# EAGLE schematic BEP32_12nutzen_90Grad (EAGLE 6.4), part 2 of 4
## Sheet 5 of 12
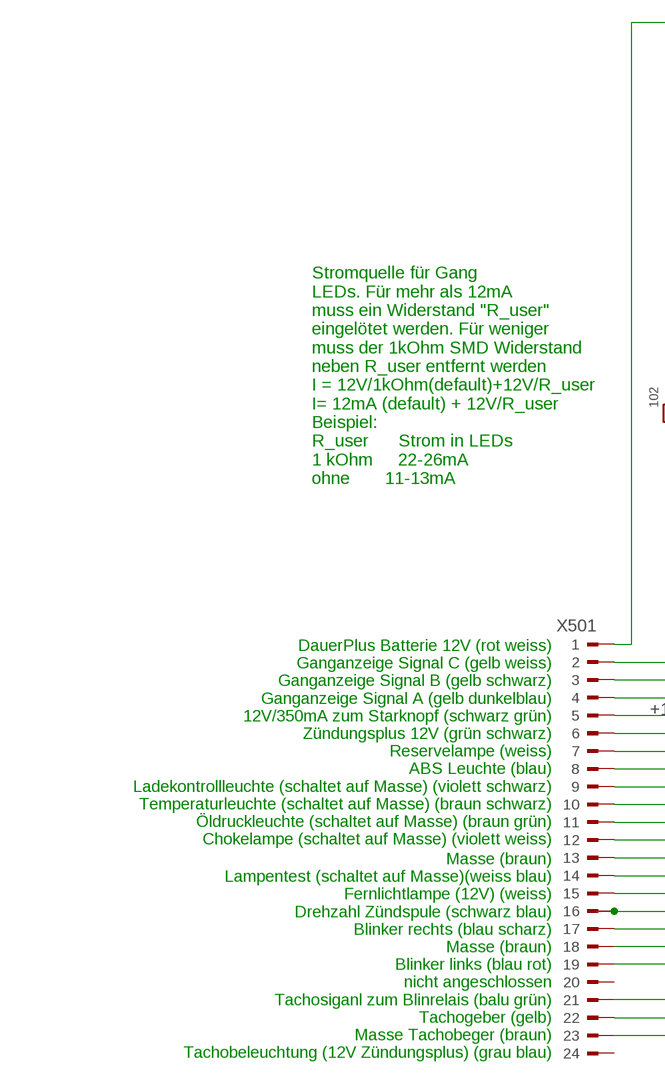
[diagram p8: schematic, sheet 5, part 1 of 2]
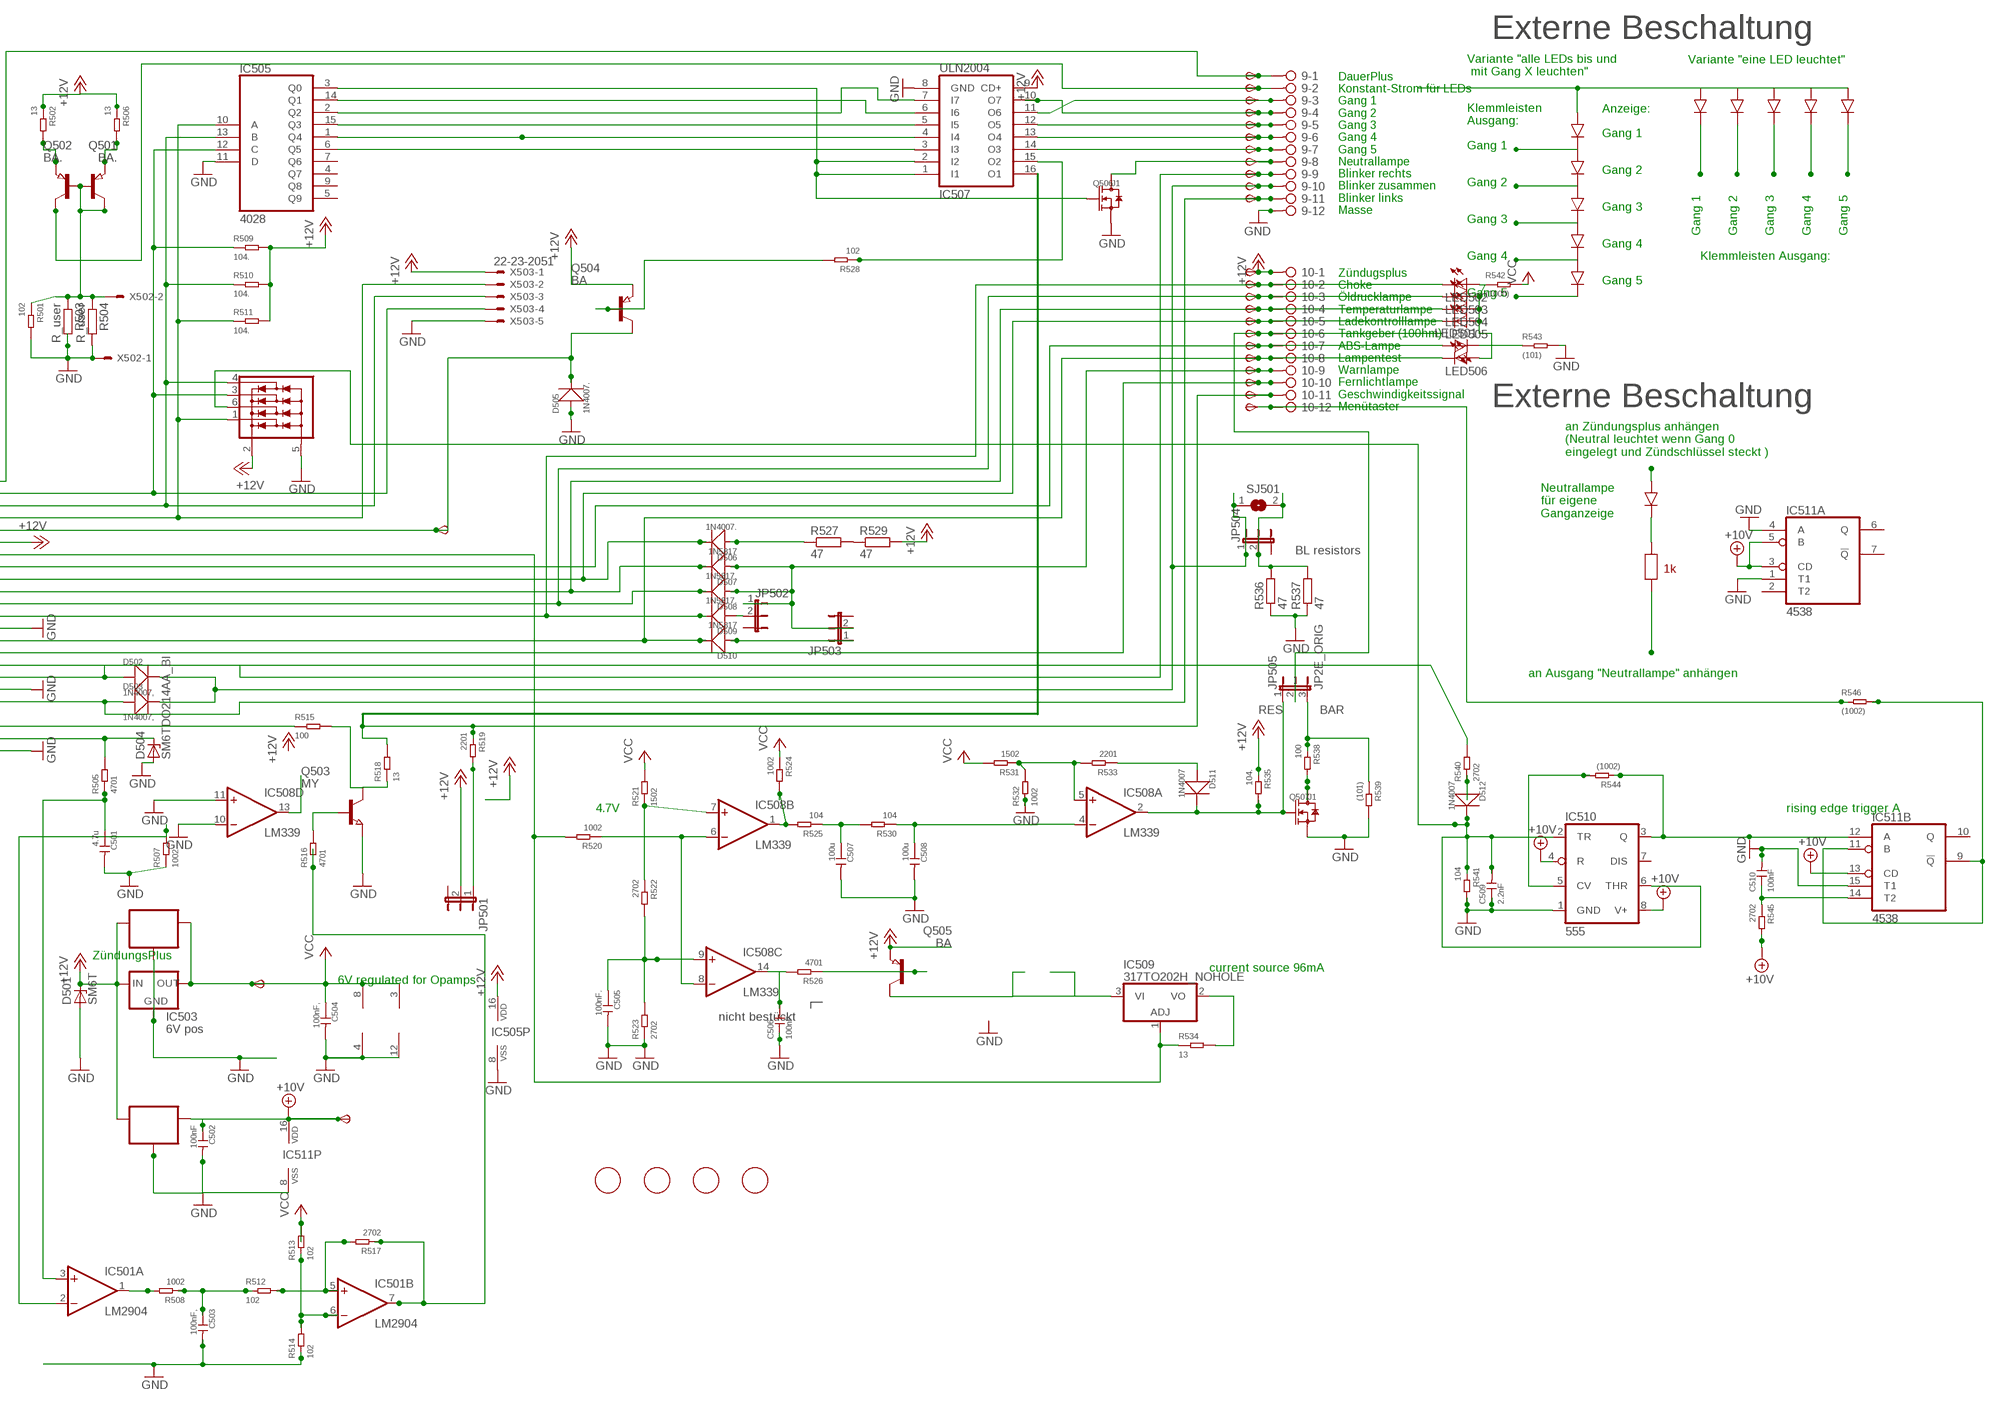
[diagram p9: schematic, sheet 5, part 2 of 2]

### Parts
6V501  TPSB2.0  [B2.0]
9  2081-1132  [12-PIN]
10  2081-1132  [12-PIN]
10V501  TPSB2.0  [B2.0]
C501  4.7u  CERAMIC-4.7UF-25V-10%-X5R(0805)  [C0805]
C502  100nF  CERAMIC-100NF-50V-10%-X7R(0805)  [C0805]
C503  100nF,  CERAMIC-100NF-50V-10%-X7R(0805)  [C0805]
C504  100nF,  CERAMIC-100NF-50V-10%-X7R(0805)  [C0805]
C505  100nF.  CERAMIC-100NF-50V-10%-X7R(0805)  [C0805]
C506  100nF.  CERAMIC-100NF-50V-10%-X7R(0805)  [C0805]
C507  100u  CERAMIC-100UF-6.3V-20%-X5R(1206)  [C1206]
C508  100u  CERAMIC-100UF-6.3V-20%-X5R(1206)  [C1206]
C509  2.2nF  CERAMIC-100NF-50V-10%-X7R(0805)  [C0805]
C510  100nF  CERAMIC-100NF-50V-10%-X7R(0805)  [C0805]
D501  SM6T  [DO214AA]
D502  1N4007,  DIODE-GEN-PURPOSE-1KV-1A(DO-214AC)  [DO-214AC]
D503  1N4007,  DIODE-GEN-PURPOSE-1KV-1A(DO-214AC)  [DO-214AC]
D504  SM6TDO214AA_BI  [DO214AA_BI]
D505  1N4007.  DIODE-GEN-PURPOSE-1KV-1A(DO-214AC)  [DO-214AC]
D506  1N4007.  DIODE-GEN-PURPOSE-1KV-1A(DO-214AC)  [DO-214AC]
D507  1N5817  DIODE-GEN-PURPOSE-1KV-1A(DO-214AC)DO-214AC/1206  [DO-214AC_SLIM]
D508  1N5817.  DIODE-GEN-PURPOSE-1KV-1A(DO-214AC)DO-214AC/1206  [DO-214AC_SLIM]
D509  1N5817.  DIODE-GEN-PURPOSE-1KV-1A(DO-214AC)DO-214AC/1206  [DO-214AC_SLIM]
D510  1N5817  DIODE-GEN-PURPOSE-1KV-1A(DO-214AC)DO-214AC/1206  [DO-214AC_SLIM]
D511  1N4007  DIODE-GEN-PURPOSE-1KV-1A(DO-214AC)  [DO-214AC]
D512  1N4007  DIODE-GEN-PURPOSE-1KV-1A(DO-214AC)  [DO-214AC]
FID501  FIDUCIAL  [FIDUCIAL_1MM]
FID502  FIDUCIAL  [FIDUCIAL_1MM]
FID503  FIDUCIAL  [FIDUCIAL_1MM]
FID504  FIDUCIAL  [FIDUCIAL_1MM]
IC501  LM2904  LM358D  [SO08]
IC502  78L06  78LXXSOT89_ROUND  [SOT89_ROUND]
IC503  6V pos  78LXX  [78LXX]
IC504  78L10  78LXXSOT89_ROUND  [SOT89_ROUND]
IC505  4028  4028D  [SO16]
IC506  NUP4304SOT457_R  [SOT457R_PHILIPS]
IC507  ULN2004  ULN2004AD  [SO16]
IC508  LM339  LM339D  [SO14]
IC509  317TO202H_NOHOLE  [TO220H_NOHOLE]
IC510  555  NE555D  [SO08]
IC511  4538  4538D  [SO16]
JP501  JP2EJP2_SMALLPADS  [JP2_SMALLPADS]
JP502  JP2EJP2_SMALLPADS  [JP2_SMALLPADS]
JP503  JP2EJP2_SMALLPADS  [JP2_SMALLPADS]
JP504  JP2EJP2_SMALLPADS  [JP2_SMALLPADS]
JP505  JP2E_ORIG  [JP2_ORIG_SMALLPADS]
LED501  LEDLD260  [LD260]
LED502  LEDLD260  [LD260]
LED503  LEDLD260  [LD260]
LED504  LEDLD260  [LD260]
LED505  LEDLD260  [LD260]
LED506  LEDLD260  [LD260]
Q501  BA.  PNP-TRANSISTOR_SOT89  [SOT89]
Q502  BA.  PNP-TRANSISTOR_SOT89  [SOT89]
Q503  MY  NPN-TRANSISTOR_SOT89  [SOT89]
Q504  BA  PNP-TRANSISTOR_SOT89  [SOT89]
Q505  BA  PNP-TRANSISTOR_SOT89  [SOT89]
Q506  J1  SMD-MOSFET-N-CH-50V-200MA-BSS138W-7-F(SOT-23)  [SOT-23]
Q507  J1  SMD-MOSFET-N-CH-50V-200MA-BSS138W-7-F(SOT-23)  [SOT-23]
R501  102  SMD-RES-1K-5%-1/8W(0805)  [R0805]
R502  13  SMD-RES-13R-5%-1/4W(1206)  [R1206]
R503  R_user  R-EU_R0805  [R0805]
R504  R_user  R-EU_R0805  [R0805]
R505  4701  SMD-RES-4.7K-5%-1/8W(0805)  [R0805]
R506  13  SMD-RES-13R-5%-1/4W(1206)  [R1206]
R507  1002  SMD-RES-10K-1%-1/8W(0805)  [R0805]
R508  1002  SMD-RES-10K-1%-1/8W(0805)  [R0805]
R509  104.  SMD-RES-10K-1%-1/8W(0805)  [R0805]
R510  104.  SMD-RES-10K-1%-1/8W(0805)  [R0805]
R511  104.  SMD-RES-10K-1%-1/8W(0805)  [R0805]
R512  102  SMD-RES-1K-5%-1/8W(0805)  [R0805]
R513  102  SMD-RES-1K-5%-1/8W(0805)  [R0805]
R514  102  SMD-RES-1K-5%-1/8W(0805)  [R0805]
R515  100  SMD-RES-220R-5%-1/8W(0805)  [R0805]
R516  4701  SMD-RES-4.7K-5%-1/8W(0805)  [R0805]
R517  2702  SMD-RES-4.7K-5%-1/8W(0805)  [R0805]
R518  13  SMD-RES-13R-5%-1/4W(1206)  [R1206]
R519  2201  SMD-RES-2.2K-5%-1/8W(0805)  [R0805]
R520  1002  SMD-RES-10K-1%-1/8W(0805)  [R0805]
R521  1502  SMD-RES-10K-1%-1/8W(0805)  [R0805]
R522  2702  SMD-RES-4.7K-5%-1/8W(0805)  [R0805]
R523  2702  SMD-RES-4.7K-5%-1/8W(0805)  [R0805]
R524  1002  SMD-RES-10K-1%-1/8W(0805)  [R0805]
R525  104  SMD-RES-10K-1%-1/8W(0805)  [R0805]
R526  4701  SMD-RES-4.7K-5%-1/8W(0805)  [R0805]
R527  47  R-EU_V235/17_1MM  [V235/17_1MM]
R528  102  SMD-RES-1K-5%-1/8W(0805)  [R0805]
R529  47  R-EU_V235/17_1MM  [V235/17_1MM]
R530  104  SMD-RES-10K-1%-1/8W(0805)  [R0805]
R531  1502  SMD-RES-10K-1%-1/8W(0805)  [R0805]
R532  1002  SMD-RES-10K-1%-1/8W(0805)  [R0805]
R533  2201  SMD-RES-2.2K-5%-1/8W(0805)  [R0805]
R534  13  SMD-RES-13R-5%-1/4W(1206)  [R1206]
R535  104.  SMD-RES-10K-1%-1/8W(0805)  [R0805]
R536  47  R-EU_V235/17_1MM  [V235/17_1MM]
R537  47  R-EU_V235/17_1MM  [V235/17_1MM]
R538  100  SMD-RES-2.2K-5%-1/8W(0805)  [R0805]
R539  (101)  SMD-RES-2.2K-5%-1/8W(0805)  [R0805]
R540  2702  SMD-RES-10K-1%-1/8W(0805)  [R0805]
R541  104  SMD-RES-10K-1%-1/8W(0805)  [R0805]
R542  (1000)  SMD-RES-100R-5%-1/8W(0805)  [R0805]
R543  (101)  SMD-RES-100R-5%-1/8W(0805)  [R0805]
R544  (1002)  SMD-RES-10K-1%-1/8W(0805)  [R0805]
R545  2702  SMD-RES-4.7K-5%-1/8W(0805)  [R0805]
R546  (1002)  SMD-RES-4.7K-5%-1/8W(0805)  [R0805]
SJ501  SJ  [SJ]
START501  TPSB2.0  [B2.0]
TP93  TPSB2.0  [B2.0]
TP94  TPSB2.0  [B2.0]
TP95  TPSB2.0  [B2.0]
TP96  TPSB2.0  [B2.0]
TP97  TPSB2.0  [B2.0]
TP98  TPSB2.0  [B2.0]
TP99  TPSB2.0  [B2.0]
TP100  TPSB2.0  [B2.0]
TP101  TPSB2.0  [B2.0]
TP102  TPSB2.0  [B2.0]
TP103  TPSB2.0  [B2.0]
TP104  TPSB2.0  [B2.0]
TP105  TPSB2.0  [B2.0]
TP106  TPSB2.0  [B2.0]
TP107  TPSB2.0  [B2.0]
TP108  TPSB2.0  [B2.0]
TP109  TPSB2.0  [B2.0]
TP110  TPSB2.0  [B2.0]
TP111  TPSB1,27  [B1,27]
TP112  TPSB2.0  [B2.0]
TP113  TPSB2.0  [B2.0]
TP114  TPSB2.0  [B2.0]
TP115  TPSB2.0  [B2.0]
X501  CON_BMWV2  [24-PIN_V2]
X502  22-23-2021  [22-23-2021]
X503  22-23-2051  [22-23-2051]

### Nets
+10V: 10V501.TP(PP) C502.1 IC504.1(OUT) IC510.4(R) IC510.8(V+) IC511.3(A:CD) IC511.5(A:B) IC511.13(B:CD) IC511.16(P:VDD) R545.2 ; also sheet 1,2,3,4,6,7,8,9,10,11,12
+12V: 10.1 D501.C IC502.3(IN) IC503.IN IC504.3(IN) IC505.16(VDD) IC506.2(V+) IC507.9(CD+) JP501.2 Q504.3(E) Q505.3(E) R502.1 R506.1 R509.2 R510.2 R511.2 R529.2 R535.1 TP114.TP(PP) X501.6 X503.1 ; also sheet 1,2,3,4,6,7,8,9,10,11,12
+12V5: IC501.7(B:OUT) R516.1 R517.1
GND: 9.12 C501.2 C502.2 C503.2 C504.2 C505.2 C506.1 C507.2 C508.2 C509.1 C510.2 D501.A D504.A D505.1(+) IC501.4(P:V-) IC502.2(GND) IC502.2@1(GND) IC503.GND IC504.2(GND) IC504.2@1(GND) IC505.8(VSS) IC505.11(D) IC506.5(V-) IC507.8(GND) IC508.10(D:-IN) IC508.11(D:+IN) IC508.12(P:GND) IC510.1(GND) IC511.1(A:T1) IC511.4(A:A) IC511.8(P:VSS) IC511.15(B:T1) Q503.3(E) Q506.2(S) Q507.2(S) R501.2 R503.2 R504.2 R507.1 R514.1 R523.1 R532.1 R536.1 R537.1 R539.2 R541.2 R543.2 X501.13 X501.18 X501.23 X502.1 X503.5 ; also sheet 1,2,3,4,6,7,8,9,10,11,12
N$389: R527.2 R529.1
N$390: 10.9 D507.1(+) D508.1(+) JP502.1 JP503.2 TP111.TP(PP)
N$391: IC505.10(A) IC506.1(D1) R511.1 X501.4 X503.2
N$392: IC505.13(B) IC506.4(D4) R510.1 X501.3 X503.3
N$393: D505.2(-) Q504.2(C) START501.TP(PP) X501.5
N$394: IC505.12(C) IC506.3(D3) R509.1 X501.2 X503.4
N$395: 10.7 LED501.A TP109.TP(PP) X501.8
N$396: 10.2 D509.2(-) LED502.K(C) TP104.TP(PP) X501.12
N$397: 10.3 D508.2(-) LED503.K(C) TP105.TP(PP) X501.11
N$398: 10.4 D507.2(-) LED504.K(C) TP106.TP(PP) X501.10
N$399: 10.8 D510.2(-) LED506.K(C) TP110.TP(PP) X501.14
N$400: 9.9 D502.1(+) TP101.TP(PP) X501.17
N$401: 9.11 D503.1(+) TP103.TP(PP) X501.19
N$402: D504.C R505.2 X501.22
N$403: C501.1 IC501.3(A:+IN) R505.1
N$404: 10.11 IC507.16(O1) R518.2 R519.1 TP113.TP(PP)
N$405: IC508.1(B:OUT) R524.2 R525.2
N$406: C507.1 R525.1 R530.2
N$407: C508.1 IC508.4(A:-IN) R530.1
N$408: IC508.5(A:+IN) R531.1 R532.2 R533.2
N$409: D511.1(+) R533.1
N$410: C505.1 IC508.9(C:+IN) R522.2 R523.2
N$411: C506.2 IC508.14(C:OUT) R526.2
N$412: Q505.1(B) R526.1
N$413: IC505.2(Q2) IC507.7(I7)
N$414: 9.5 IC507.12(O5) TP97.TP(PP)
N$415: IC505.1(Q4) IC507.4(I4)
N$416: 9.8 Q506.3(D) TP100.TP(PP)
N$417: 10.10 TP112.TP(PP) X501.15
N$418: 10.5 D506.2(-) LED505.K(C) TP107.TP(PP) X501.9
N$419: D506.1(+) R527.1
N$420: IC505.6(Q5) IC507.3(I3)
N$421: 9.4 IC507.10(O7) TP96.TP(PP)
N$422: IC509.1(ADJ) R520.2 R534.1 X501.7
N$423: IC508.6(B:-IN) IC508.8(C:-IN) R520.1
N$424: 9.2 Q501.2(C) TP94.TP(PP)
N$425: 9.1 TP93.TP(PP) X501.1
N$439: R540.2 X501.16
N$440: IC505.15(Q3) IC507.5(I5)
N$441: 9.6 IC507.13(O4) TP98.TP(PP)
N$442: 9.7 IC507.14(O3) TP99.TP(PP)
N$443: 10.6 JP505.2 TP108.TP(PP)
N$444: LED501.K(C) R543.1
N$445: LED502.A LED503.A LED504.A LED505.A LED506.A R542.1
N$446: Q504.1(B) R528.2
N$447: IC505.3(Q0) IC507.1(I1) IC507.2(I2) Q506.1(G)
N$448: IC505.14(Q1) IC507.6(I6)
N$449: 9.3 IC507.11(O6) TP95.TP(PP)
N$450: Q501.1(B) Q502.1(B) Q502.2(C) R501.1 R503.1 R504.1 X502.2
N$451: Q501.3(E) R502.2
N$452: Q502.3(E) R506.2
N$453: IC508.7(B:+IN) R521.1 R522.1
N$454: IC501.2(A:-IN) R507.2
N$455: Q503.1(B) R516.2
N$456: Q507.3(D) R538.2
N$457: IC509.2(VO) R534.2
N$458: IC509.3(VI) Q505.2(C)
N$459: C509.2 D512.2(-) IC506.6(D2) IC510.2(TR) IC510.6(THR) R541.1
N$460: IC510.5(CV) R544.2
N$461: IC510.3(Q) IC511.12(B:A) R544.1
N$462: D512.1(+) R540.1
N$463: 9.10 D502.2(-) D503.2(-) JP504.1 SJ501.1 TP102.TP(PP)
N$464: JP504.2 R536.2 R537.2 SJ501.2
N$465: IC511.9(B:!Q) IC511.11(B:B) R546.2
N$466: C510.1 IC511.14(B:T2) R545.1
N$467: JP501.1 R519.2
N$468: IC507.15(O2) R528.1
N$469: 10.12 R546.1 TP115.TP(PP)
N$470: D509.1(+) JP502.2
N$471: D511.2(-) IC508.2(A:OUT) JP505.1 Q507.1(G) R535.2
N$472: IC501.1(A:OUT) R508.2
N$473: C503.1 R508.1 R512.1
N$474: IC501.5(B:+IN) R512.2 R517.2
N$475: IC501.6(B:-IN) R513.1 R514.2
N$476: D510.1(+) JP503.1
N$477: JP505.3 R538.1 R539.1
N$478: IC508.13(D:OUT)
N$479: R515.1 X501.21
N$480: Q503.2(C) R515.2 R518.1
VCC: 6V501.TP(PP) C504.1 IC501.8(P:V+) IC502.1(OUT) IC503.OUT IC508.3(P:V+) R513.2 R521.2 R524.1 R531.2 R542.2 ; also sheet 1,2,3,4,6,7,8,9,10,11,12
Unconnected: IC505.4(Q7) IC505.5(Q9) IC505.7(Q6) IC505.9(Q8) IC510.7(DIS) IC511.2(A:T2) IC511.6(A:Q) IC511.7(A:!Q) IC511.10(B:Q) X501.20 X501.24

### Notes on the sheet
- Externe Beschaltung
- Variante "eine LED leuchtet"
- Variante "alle LEDs bis und
   mit Gang X leuchten"
- Anzeige:
- Klemmleisten
  Ausgang:
- Gang 1
- DauerPlus
  Konstant-Strom für LEDs
  Gang 1
  Gang 2
  Gang 3
  Gang 4
  Gang 5
  Neutrallampe
  Blinker rechts
  Blinker zusammen
  Blinker links
  Masse
- Gang 1
- Gang 2
- Gang 2
- Gang 3
- Gang 3
- Gang 1 | Gang 2 | Gang 3 | Gang 4 | Gang 5
- Gang 4
- Gang 4 | Klemmleisten Ausgang:
- Gang 5
- Gang 5
- Zündugsplus
  Choke
  Öldrucklampe
  Temperaturlampe
  Ladekontrolllampe
  Tankgeber (100hm)
  ABS-Lampe
  Lampentest
  Warnlampe
  Fernlichtlampe
  Geschwindigkeitssignal
  Menütaster
- Stromquelle für Gang
  LEDs. Für mehr als 12mA
  muss ein Widerstand "R_user"
  eingelötet werden. Für weniger
  muss der 1kOhm SMD Widerstand
  neben R_user entfernt werden
  I = 12V/1kOhm(default)+12V/R_user
  I= 12mA (default) + 12V/R_user
  Beispiel:
  R_user      Strom in LEDs
  1 kOhm     22-26mA
  ohne       11-13mA
- Externe Beschaltung
- an Zündungsplus anhängen
  (Neutral leuchtet wenn Gang 0
  eingelegt und Zündschlüssel steckt )
- Neutrallampe
  für eigene
  Ganganzeige
- DauerPlus Batterie 12V (rot weiss)
  Ganganzeige Signal C (gelb weiss)
  Ganganzeige Signal B (gelb schwarz)
  Ganganzeige Signal A (gelb dunkelblau)
  12V/350mA zum Starknopf (schwarz grün)
  Zündungsplus 12V (grün schwarz)
  Reservelampe (weiss)
  ABS Leuchte (blau)
  Ladekontrollleuchte (schaltet auf Masse) (violett schwarz)
  Temperaturleuchte (schaltet auf Masse) (braun schwarz)
  Öldruckleuchte (schaltet auf Masse) (braun grün)
  Chokelampe (schaltet auf Masse) (violett weiss)
- BL resistors
- 1k
- an Ausgang "Neutrallampe" anhängen
- Masse (braun)
  Lampentest (schaltet auf Masse)(weiss blau)
  Fernlichtlampe (12V) (weiss)
  Drehzahl Zündspule (schwarz blau)
  Blinker rechts (blau scharz)
  Masse (braun)
  Blinker links (blau rot)
  nicht angeschlossen
  Tachosiganl zum Blinrelais (balu grün)
  Tachogeber (gelb)
  Masse Tachobeger (braun)
  Tachobeleuchtung (12V Zündungsplus) (grau blau)
- RES | BAR
- 4.7V | rising edge trigger A
- ZündungsPlus
- current source 96mA
- 6V regulated for Opamps
- nicht bestückt

## Sheet 6 of 12
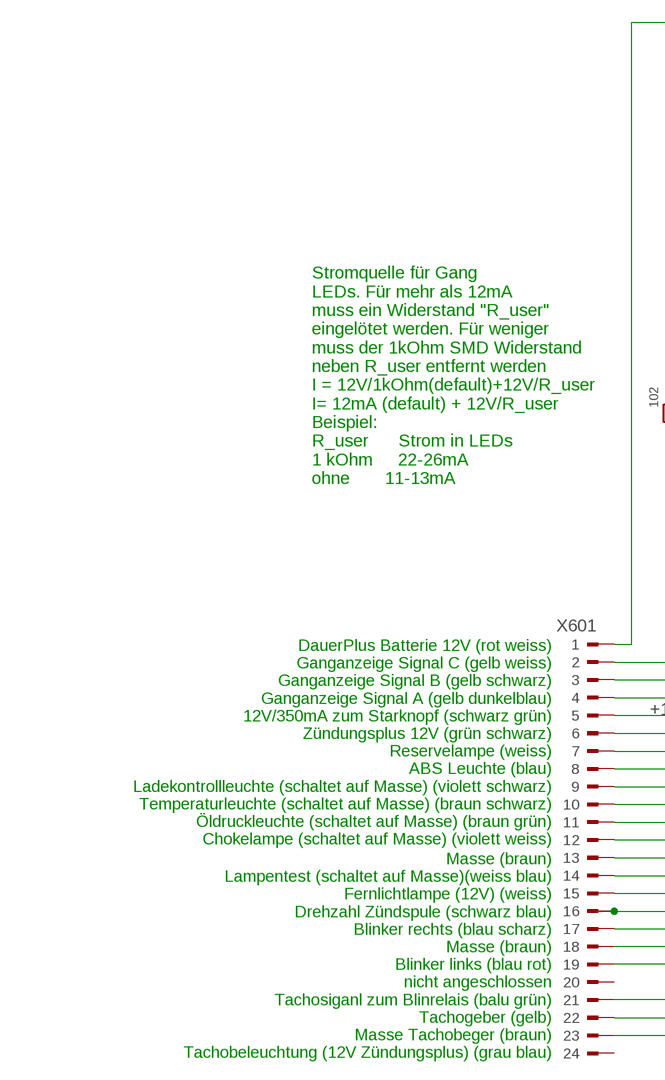
[diagram p10: schematic, sheet 6, part 1 of 2]
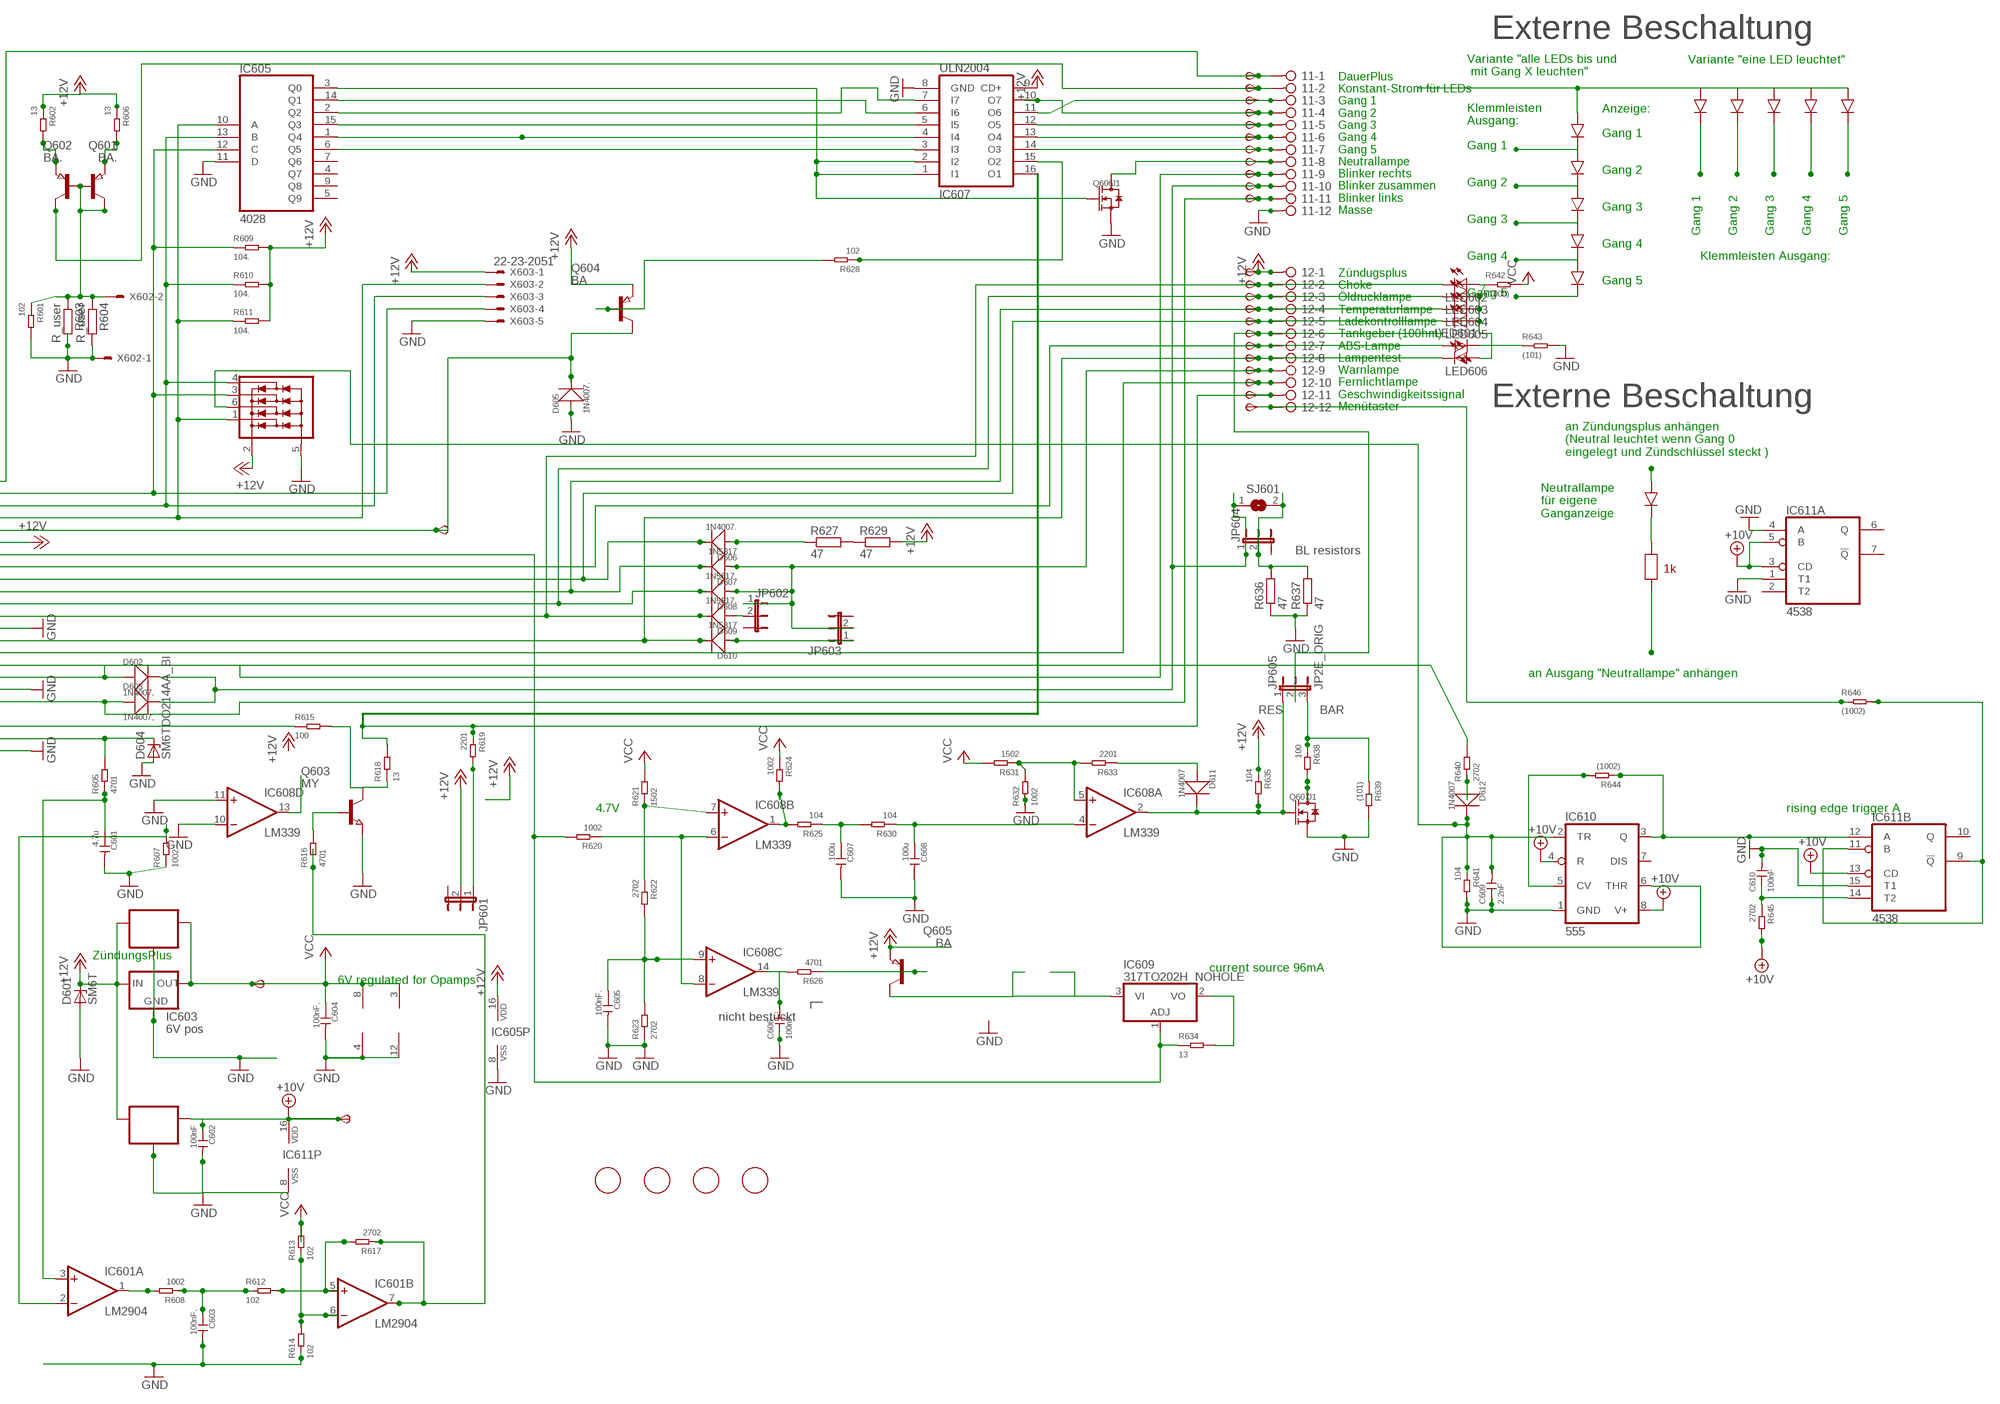
[diagram p11: schematic, sheet 6, part 2 of 2]

### Parts
6V601  TPSB2.0  [B2.0]
10V601  TPSB2.0  [B2.0]
11  2081-1132  [12-PIN]
12  2081-1132  [12-PIN]
C601  4.7u  CERAMIC-4.7UF-25V-10%-X5R(0805)  [C0805]
C602  100nF  CERAMIC-100NF-50V-10%-X7R(0805)  [C0805]
C603  100nF,  CERAMIC-100NF-50V-10%-X7R(0805)  [C0805]
C604  100nF,  CERAMIC-100NF-50V-10%-X7R(0805)  [C0805]
C605  100nF.  CERAMIC-100NF-50V-10%-X7R(0805)  [C0805]
C606  100nF.  CERAMIC-100NF-50V-10%-X7R(0805)  [C0805]
C607  100u  CERAMIC-100UF-6.3V-20%-X5R(1206)  [C1206]
C608  100u  CERAMIC-100UF-6.3V-20%-X5R(1206)  [C1206]
C609  2.2nF  CERAMIC-100NF-50V-10%-X7R(0805)  [C0805]
C610  100nF  CERAMIC-100NF-50V-10%-X7R(0805)  [C0805]
D601  SM6T  [DO214AA]
D602  1N4007,  DIODE-GEN-PURPOSE-1KV-1A(DO-214AC)  [DO-214AC]
D603  1N4007,  DIODE-GEN-PURPOSE-1KV-1A(DO-214AC)  [DO-214AC]
D604  SM6TDO214AA_BI  [DO214AA_BI]
D605  1N4007.  DIODE-GEN-PURPOSE-1KV-1A(DO-214AC)  [DO-214AC]
D606  1N4007.  DIODE-GEN-PURPOSE-1KV-1A(DO-214AC)  [DO-214AC]
D607  1N5817  DIODE-GEN-PURPOSE-1KV-1A(DO-214AC)DO-214AC/1206  [DO-214AC_SLIM]
D608  1N5817.  DIODE-GEN-PURPOSE-1KV-1A(DO-214AC)DO-214AC/1206  [DO-214AC_SLIM]
D609  1N5817.  DIODE-GEN-PURPOSE-1KV-1A(DO-214AC)DO-214AC/1206  [DO-214AC_SLIM]
D610  1N5817  DIODE-GEN-PURPOSE-1KV-1A(DO-214AC)DO-214AC/1206  [DO-214AC_SLIM]
D611  1N4007  DIODE-GEN-PURPOSE-1KV-1A(DO-214AC)  [DO-214AC]
D612  1N4007  DIODE-GEN-PURPOSE-1KV-1A(DO-214AC)  [DO-214AC]
FID601  FIDUCIAL  [FIDUCIAL_1MM]
FID602  FIDUCIAL  [FIDUCIAL_1MM]
FID603  FIDUCIAL  [FIDUCIAL_1MM]
FID604  FIDUCIAL  [FIDUCIAL_1MM]
IC601  LM2904  LM358D  [SO08]
IC602  78L06  78LXXSOT89_ROUND  [SOT89_ROUND]
IC603  6V pos  78LXX  [78LXX]
IC604  78L10  78LXXSOT89_ROUND  [SOT89_ROUND]
IC605  4028  4028D  [SO16]
IC606  NUP4304SOT457_R  [SOT457R_PHILIPS]
IC607  ULN2004  ULN2004AD  [SO16]
IC608  LM339  LM339D  [SO14]
IC609  317TO202H_NOHOLE  [TO220H_NOHOLE]
IC610  555  NE555D  [SO08]
IC611  4538  4538D  [SO16]
JP601  JP2EJP2_SMALLPADS  [JP2_SMALLPADS]
JP602  JP2EJP2_SMALLPADS  [JP2_SMALLPADS]
JP603  JP2EJP2_SMALLPADS  [JP2_SMALLPADS]
JP604  JP2EJP2_SMALLPADS  [JP2_SMALLPADS]
JP605  JP2E_ORIG  [JP2_ORIG_SMALLPADS]
LED601  LEDLD260  [LD260]
LED602  LEDLD260  [LD260]
LED603  LEDLD260  [LD260]
LED604  LEDLD260  [LD260]
LED605  LEDLD260  [LD260]
LED606  LEDLD260  [LD260]
Q601  BA.  PNP-TRANSISTOR_SOT89  [SOT89]
Q602  BA.  PNP-TRANSISTOR_SOT89  [SOT89]
Q603  MY  NPN-TRANSISTOR_SOT89  [SOT89]
Q604  BA  PNP-TRANSISTOR_SOT89  [SOT89]
Q605  BA  PNP-TRANSISTOR_SOT89  [SOT89]
Q606  J1  SMD-MOSFET-N-CH-50V-200MA-BSS138W-7-F(SOT-23)  [SOT-23]
Q607  J1  SMD-MOSFET-N-CH-50V-200MA-BSS138W-7-F(SOT-23)  [SOT-23]
R601  102  SMD-RES-1K-5%-1/8W(0805)  [R0805]
R602  13  SMD-RES-13R-5%-1/4W(1206)  [R1206]
R603  R_user  R-EU_R0805  [R0805]
R604  R_user  R-EU_R0805  [R0805]
R605  4701  SMD-RES-4.7K-5%-1/8W(0805)  [R0805]
R606  13  SMD-RES-13R-5%-1/4W(1206)  [R1206]
R607  1002  SMD-RES-10K-1%-1/8W(0805)  [R0805]
R608  1002  SMD-RES-10K-1%-1/8W(0805)  [R0805]
R609  104.  SMD-RES-10K-1%-1/8W(0805)  [R0805]
R610  104.  SMD-RES-10K-1%-1/8W(0805)  [R0805]
R611  104.  SMD-RES-10K-1%-1/8W(0805)  [R0805]
R612  102  SMD-RES-1K-5%-1/8W(0805)  [R0805]
R613  102  SMD-RES-1K-5%-1/8W(0805)  [R0805]
R614  102  SMD-RES-1K-5%-1/8W(0805)  [R0805]
R615  100  SMD-RES-220R-5%-1/8W(0805)  [R0805]
R616  4701  SMD-RES-4.7K-5%-1/8W(0805)  [R0805]
R617  2702  SMD-RES-4.7K-5%-1/8W(0805)  [R0805]
R618  13  SMD-RES-13R-5%-1/4W(1206)  [R1206]
R619  2201  SMD-RES-2.2K-5%-1/8W(0805)  [R0805]
R620  1002  SMD-RES-10K-1%-1/8W(0805)  [R0805]
R621  1502  SMD-RES-10K-1%-1/8W(0805)  [R0805]
R622  2702  SMD-RES-4.7K-5%-1/8W(0805)  [R0805]
R623  2702  SMD-RES-4.7K-5%-1/8W(0805)  [R0805]
R624  1002  SMD-RES-10K-1%-1/8W(0805)  [R0805]
R625  104  SMD-RES-10K-1%-1/8W(0805)  [R0805]
R626  4701  SMD-RES-4.7K-5%-1/8W(0805)  [R0805]
R627  47  R-EU_V235/17_1MM  [V235/17_1MM]
R628  102  SMD-RES-1K-5%-1/8W(0805)  [R0805]
R629  47  R-EU_V235/17_1MM  [V235/17_1MM]
R630  104  SMD-RES-10K-1%-1/8W(0805)  [R0805]
R631  1502  SMD-RES-10K-1%-1/8W(0805)  [R0805]
R632  1002  SMD-RES-10K-1%-1/8W(0805)  [R0805]
R633  2201  SMD-RES-2.2K-5%-1/8W(0805)  [R0805]
R634  13  SMD-RES-13R-5%-1/4W(1206)  [R1206]
R635  104  SMD-RES-10K-1%-1/8W(0805)  [R0805]
R636  47  R-EU_V235/17_1MM  [V235/17_1MM]
R637  47  R-EU_V235/17_1MM  [V235/17_1MM]
R638  100  SMD-RES-2.2K-5%-1/8W(0805)  [R0805]
R639  (101)  SMD-RES-2.2K-5%-1/8W(0805)  [R0805]
R640  2702  SMD-RES-10K-1%-1/8W(0805)  [R0805]
R641  104  SMD-RES-10K-1%-1/8W(0805)  [R0805]
R642  (1000)  SMD-RES-100R-5%-1/8W(0805)  [R0805]
R643  (101)  SMD-RES-100R-5%-1/8W(0805)  [R0805]
R644  (1002)  SMD-RES-10K-1%-1/8W(0805)  [R0805]
R645  2702  SMD-RES-4.7K-5%-1/8W(0805)  [R0805]
R646  (1002)  SMD-RES-4.7K-5%-1/8W(0805)  [R0805]
SJ601  SJ  [SJ]
START601  TPSB2.0  [B2.0]
TP116  TPSB2.0  [B2.0]
TP117  TPSB2.0  [B2.0]
TP118  TPSB2.0  [B2.0]
TP119  TPSB2.0  [B2.0]
TP120  TPSB2.0  [B2.0]
TP121  TPSB2.0  [B2.0]
TP122  TPSB2.0  [B2.0]
TP123  TPSB2.0  [B2.0]
TP124  TPSB2.0  [B2.0]
TP125  TPSB2.0  [B2.0]
TP126  TPSB2.0  [B2.0]
TP127  TPSB2.0  [B2.0]
TP128  TPSB2.0  [B2.0]
TP129  TPSB2.0  [B2.0]
TP130  TPSB2.0  [B2.0]
TP131  TPSB2.0  [B2.0]
TP132  TPSB2.0  [B2.0]
TP133  TPSB2.0  [B2.0]
TP134  TPSB1,27  [B1,27]
TP135  TPSB2.0  [B2.0]
TP136  TPSB2.0  [B2.0]
TP137  TPSB2.0  [B2.0]
TP138  TPSB2.0  [B2.0]
X601  CON_BMWV2  [24-PIN_V2]
X602  22-23-2021  [22-23-2021]
X603  22-23-2051  [22-23-2051]

### Nets
+10V: 10V601.TP(PP) C602.1 IC604.1(OUT) IC610.4(R) IC610.8(V+) IC611.3(A:CD) IC611.5(A:B) IC611.13(B:CD) IC611.16(P:VDD) R645.2 ; also sheet 1,2,3,4,5,7,8,9,10,11,12
+12V: 12.1 D601.C IC602.3(IN) IC603.IN IC604.3(IN) IC605.16(VDD) IC606.2(V+) IC607.9(CD+) JP601.2 Q604.3(E) Q605.3(E) R602.1 R606.1 R609.2 R610.2 R611.2 R629.2 R635.1 TP137.TP(PP) X601.6 X603.1 ; also sheet 1,2,3,4,5,7,8,9,10,11,12
+12V6: IC601.7(B:OUT) R616.1 R617.1
GND: 11.12 C601.2 C602.2 C603.2 C604.2 C605.2 C606.1 C607.2 C608.2 C609.1 C610.2 D601.A D604.A D605.1(+) IC601.4(P:V-) IC602.2(GND) IC602.2@1(GND) IC603.GND IC604.2(GND) IC604.2@1(GND) IC605.8(VSS) IC605.11(D) IC606.5(V-) IC607.8(GND) IC608.10(D:-IN) IC608.11(D:+IN) IC608.12(P:GND) IC610.1(GND) IC611.1(A:T1) IC611.4(A:A) IC611.8(P:VSS) IC611.15(B:T1) Q603.3(E) Q606.2(S) Q607.2(S) R601.2 R603.2 R604.2 R607.1 R614.1 R623.1 R632.1 R636.1 R637.1 R639.2 R641.2 R643.2 X601.13 X601.18 X601.23 X602.1 X603.5 ; also sheet 1,2,3,4,5,7,8,9,10,11,12
N$481: R627.2 R629.1
N$482: 12.9 D607.1(+) D608.1(+) JP602.1 JP603.2 TP134.TP(PP)
N$483: IC605.10(A) IC606.1(D1) R611.1 X601.4 X603.2
N$484: IC605.13(B) IC606.4(D4) R610.1 X601.3 X603.3
N$485: D605.2(-) Q604.2(C) START601.TP(PP) X601.5
N$486: IC605.12(C) IC606.3(D3) R609.1 X601.2 X603.4
N$487: 12.7 LED601.A TP132.TP(PP) X601.8
N$488: 12.2 D609.2(-) LED602.K(C) TP127.TP(PP) X601.12
N$489: 12.3 D608.2(-) LED603.K(C) TP128.TP(PP) X601.11
N$490: 12.4 D607.2(-) LED604.K(C) TP129.TP(PP) X601.10
N$491: 12.8 D610.2(-) LED606.K(C) TP133.TP(PP) X601.14
N$492: 11.9 D602.1(+) TP124.TP(PP) X601.17
N$493: 11.11 D603.1(+) TP126.TP(PP) X601.19
N$494: D604.C R605.2 X601.22
N$495: C601.1 IC601.3(A:+IN) R605.1
N$496: 12.11 IC607.16(O1) R618.2 R619.1 TP136.TP(PP)
N$497: IC608.1(B:OUT) R624.2 R625.2
N$498: C607.1 R625.1 R630.2
N$499: C608.1 IC608.4(A:-IN) R630.1
N$500: IC608.5(A:+IN) R631.1 R632.2 R633.2
N$501: D611.1(+) R633.1
N$502: C605.1 IC608.9(C:+IN) R622.2 R623.2
N$503: C606.2 IC608.14(C:OUT) R626.2
N$504: Q605.1(B) R626.1
N$505: IC605.2(Q2) IC607.7(I7)
N$506: 11.5 IC607.12(O5) TP120.TP(PP)
N$507: IC605.1(Q4) IC607.4(I4)
N$508: 11.8 Q606.3(D) TP123.TP(PP)
N$509: 12.10 TP135.TP(PP) X601.15
N$510: 12.5 D606.2(-) LED605.K(C) TP130.TP(PP) X601.9
N$511: D606.1(+) R627.1
N$512: IC605.6(Q5) IC607.3(I3)
N$513: 11.4 IC607.10(O7) TP119.TP(PP)
N$514: IC609.1(ADJ) R620.2 R634.1 X601.7
N$515: IC608.6(B:-IN) IC608.8(C:-IN) R620.1
N$516: 11.2 Q601.2(C) TP117.TP(PP)
N$517: 11.1 TP116.TP(PP) X601.1
N$531: R640.2 X601.16
N$532: IC605.15(Q3) IC607.5(I5)
N$533: 11.6 IC607.13(O4) TP121.TP(PP)
N$534: 11.7 IC607.14(O3) TP122.TP(PP)
N$535: 12.6 JP605.2 TP131.TP(PP)
N$536: LED601.K(C) R643.1
N$537: LED602.A LED603.A LED604.A LED605.A LED606.A R642.1
N$538: Q604.1(B) R628.2
N$539: IC605.3(Q0) IC607.1(I1) IC607.2(I2) Q606.1(G)
N$540: IC605.14(Q1) IC607.6(I6)
N$541: 11.3 IC607.11(O6) TP118.TP(PP)
N$542: Q601.1(B) Q602.1(B) Q602.2(C) R601.1 R603.1 R604.1 X602.2
N$543: Q601.3(E) R602.2
N$544: Q602.3(E) R606.2
N$545: IC608.7(B:+IN) R621.1 R622.1
N$546: IC601.2(A:-IN) R607.2
N$547: Q603.1(B) R616.2
N$548: Q607.3(D) R638.2
N$549: IC609.2(VO) R634.2
N$550: IC609.3(VI) Q605.2(C)
N$551: C609.2 D612.2(-) IC606.6(D2) IC610.2(TR) IC610.6(THR) R641.1
N$552: IC610.5(CV) R644.2
N$553: IC610.3(Q) IC611.12(B:A) R644.1
N$554: D612.1(+) R640.1
N$555: 11.10 D602.2(-) D603.2(-) JP604.1 SJ601.1 TP125.TP(PP)
N$556: JP604.2 R636.2 R637.2 SJ601.2
N$557: IC611.9(B:!Q) IC611.11(B:B) R646.2
N$558: C610.1 IC611.14(B:T2) R645.1
N$559: JP601.1 R619.2
N$560: IC607.15(O2) R628.1
N$561: 12.12 R646.1 TP138.TP(PP)
N$562: D609.1(+) JP602.2
N$563: D611.2(-) IC608.2(A:OUT) JP605.1 Q607.1(G) R635.2
N$564: IC601.1(A:OUT) R608.2
N$565: C603.1 R608.1 R612.1
N$566: IC601.5(B:+IN) R612.2 R617.2
N$567: IC601.6(B:-IN) R613.1 R614.2
N$568: D610.1(+) JP603.1
N$569: JP605.3 R638.1 R639.1
N$570: IC608.13(D:OUT)
N$571: R615.1 X601.21
N$572: Q603.2(C) R615.2 R618.1
VCC: 6V601.TP(PP) C604.1 IC601.8(P:V+) IC602.1(OUT) IC603.OUT IC608.3(P:V+) R613.2 R621.2 R624.1 R631.2 R642.2 ; also sheet 1,2,3,4,5,7,8,9,10,11,12
Unconnected: IC605.4(Q7) IC605.5(Q9) IC605.7(Q6) IC605.9(Q8) IC610.7(DIS) IC611.2(A:T2) IC611.6(A:Q) IC611.7(A:!Q) IC611.10(B:Q) X601.20 X601.24

### Notes on the sheet
- Externe Beschaltung
- Variante "eine LED leuchtet"
- Variante "alle LEDs bis und
   mit Gang X leuchten"
- Anzeige:
- Klemmleisten
  Ausgang:
- Gang 1
- DauerPlus
  Konstant-Strom für LEDs
  Gang 1
  Gang 2
  Gang 3
  Gang 4
  Gang 5
  Neutrallampe
  Blinker rechts
  Blinker zusammen
  Blinker links
  Masse
- Gang 1
- Gang 2
- Gang 2
- Gang 3
- Gang 3
- Gang 1 | Gang 2 | Gang 3 | Gang 4 | Gang 5
- Gang 4
- Gang 4 | Klemmleisten Ausgang:
- Gang 5
- Gang 5
- Zündugsplus
  Choke
  Öldrucklampe
  Temperaturlampe
  Ladekontrolllampe
  Tankgeber (100hm)
  ABS-Lampe
  Lampentest
  Warnlampe
  Fernlichtlampe
  Geschwindigkeitssignal
  Menütaster
- Stromquelle für Gang
  LEDs. Für mehr als 12mA
  muss ein Widerstand "R_user"
  eingelötet werden. Für weniger
  muss der 1kOhm SMD Widerstand
  neben R_user entfernt werden
  I = 12V/1kOhm(default)+12V/R_user
  I= 12mA (default) + 12V/R_user
  Beispiel:
  R_user      Strom in LEDs
  1 kOhm     22-26mA
  ohne       11-13mA
- Externe Beschaltung
- an Zündungsplus anhängen
  (Neutral leuchtet wenn Gang 0
  eingelegt und Zündschlüssel steckt )
- Neutrallampe
  für eigene
  Ganganzeige
- DauerPlus Batterie 12V (rot weiss)
  Ganganzeige Signal C (gelb weiss)
  Ganganzeige Signal B (gelb schwarz)
  Ganganzeige Signal A (gelb dunkelblau)
  12V/350mA zum Starknopf (schwarz grün)
  Zündungsplus 12V (grün schwarz)
  Reservelampe (weiss)
  ABS Leuchte (blau)
  Ladekontrollleuchte (schaltet auf Masse) (violett schwarz)
  Temperaturleuchte (schaltet auf Masse) (braun schwarz)
  Öldruckleuchte (schaltet auf Masse) (braun grün)
  Chokelampe (schaltet auf Masse) (violett weiss)
- BL resistors
- 1k
- an Ausgang "Neutrallampe" anhängen
- Masse (braun)
  Lampentest (schaltet auf Masse)(weiss blau)
  Fernlichtlampe (12V) (weiss)
  Drehzahl Zündspule (schwarz blau)
  Blinker rechts (blau scharz)
  Masse (braun)
  Blinker links (blau rot)
  nicht angeschlossen
  Tachosiganl zum Blinrelais (balu grün)
  Tachogeber (gelb)
  Masse Tachobeger (braun)
  Tachobeleuchtung (12V Zündungsplus) (grau blau)
- RES | BAR
- 4.7V | rising edge trigger A
- ZündungsPlus
- current source 96mA
- 6V regulated for Opamps
- nicht bestückt

## Sheet 7 of 12
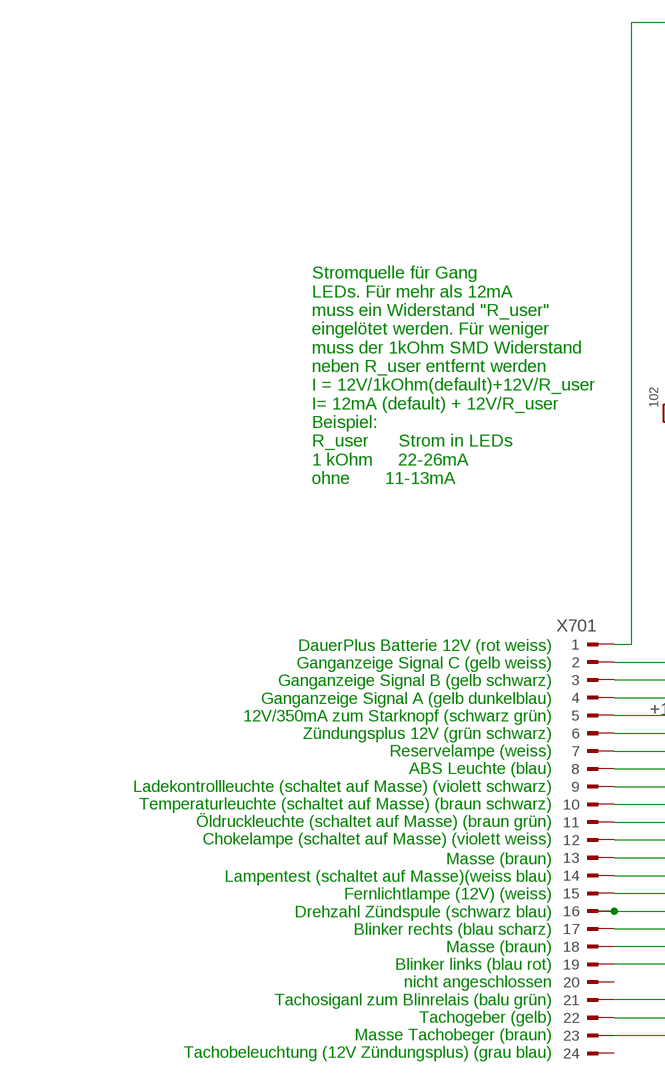
[diagram p12: schematic, sheet 7, part 1 of 2]
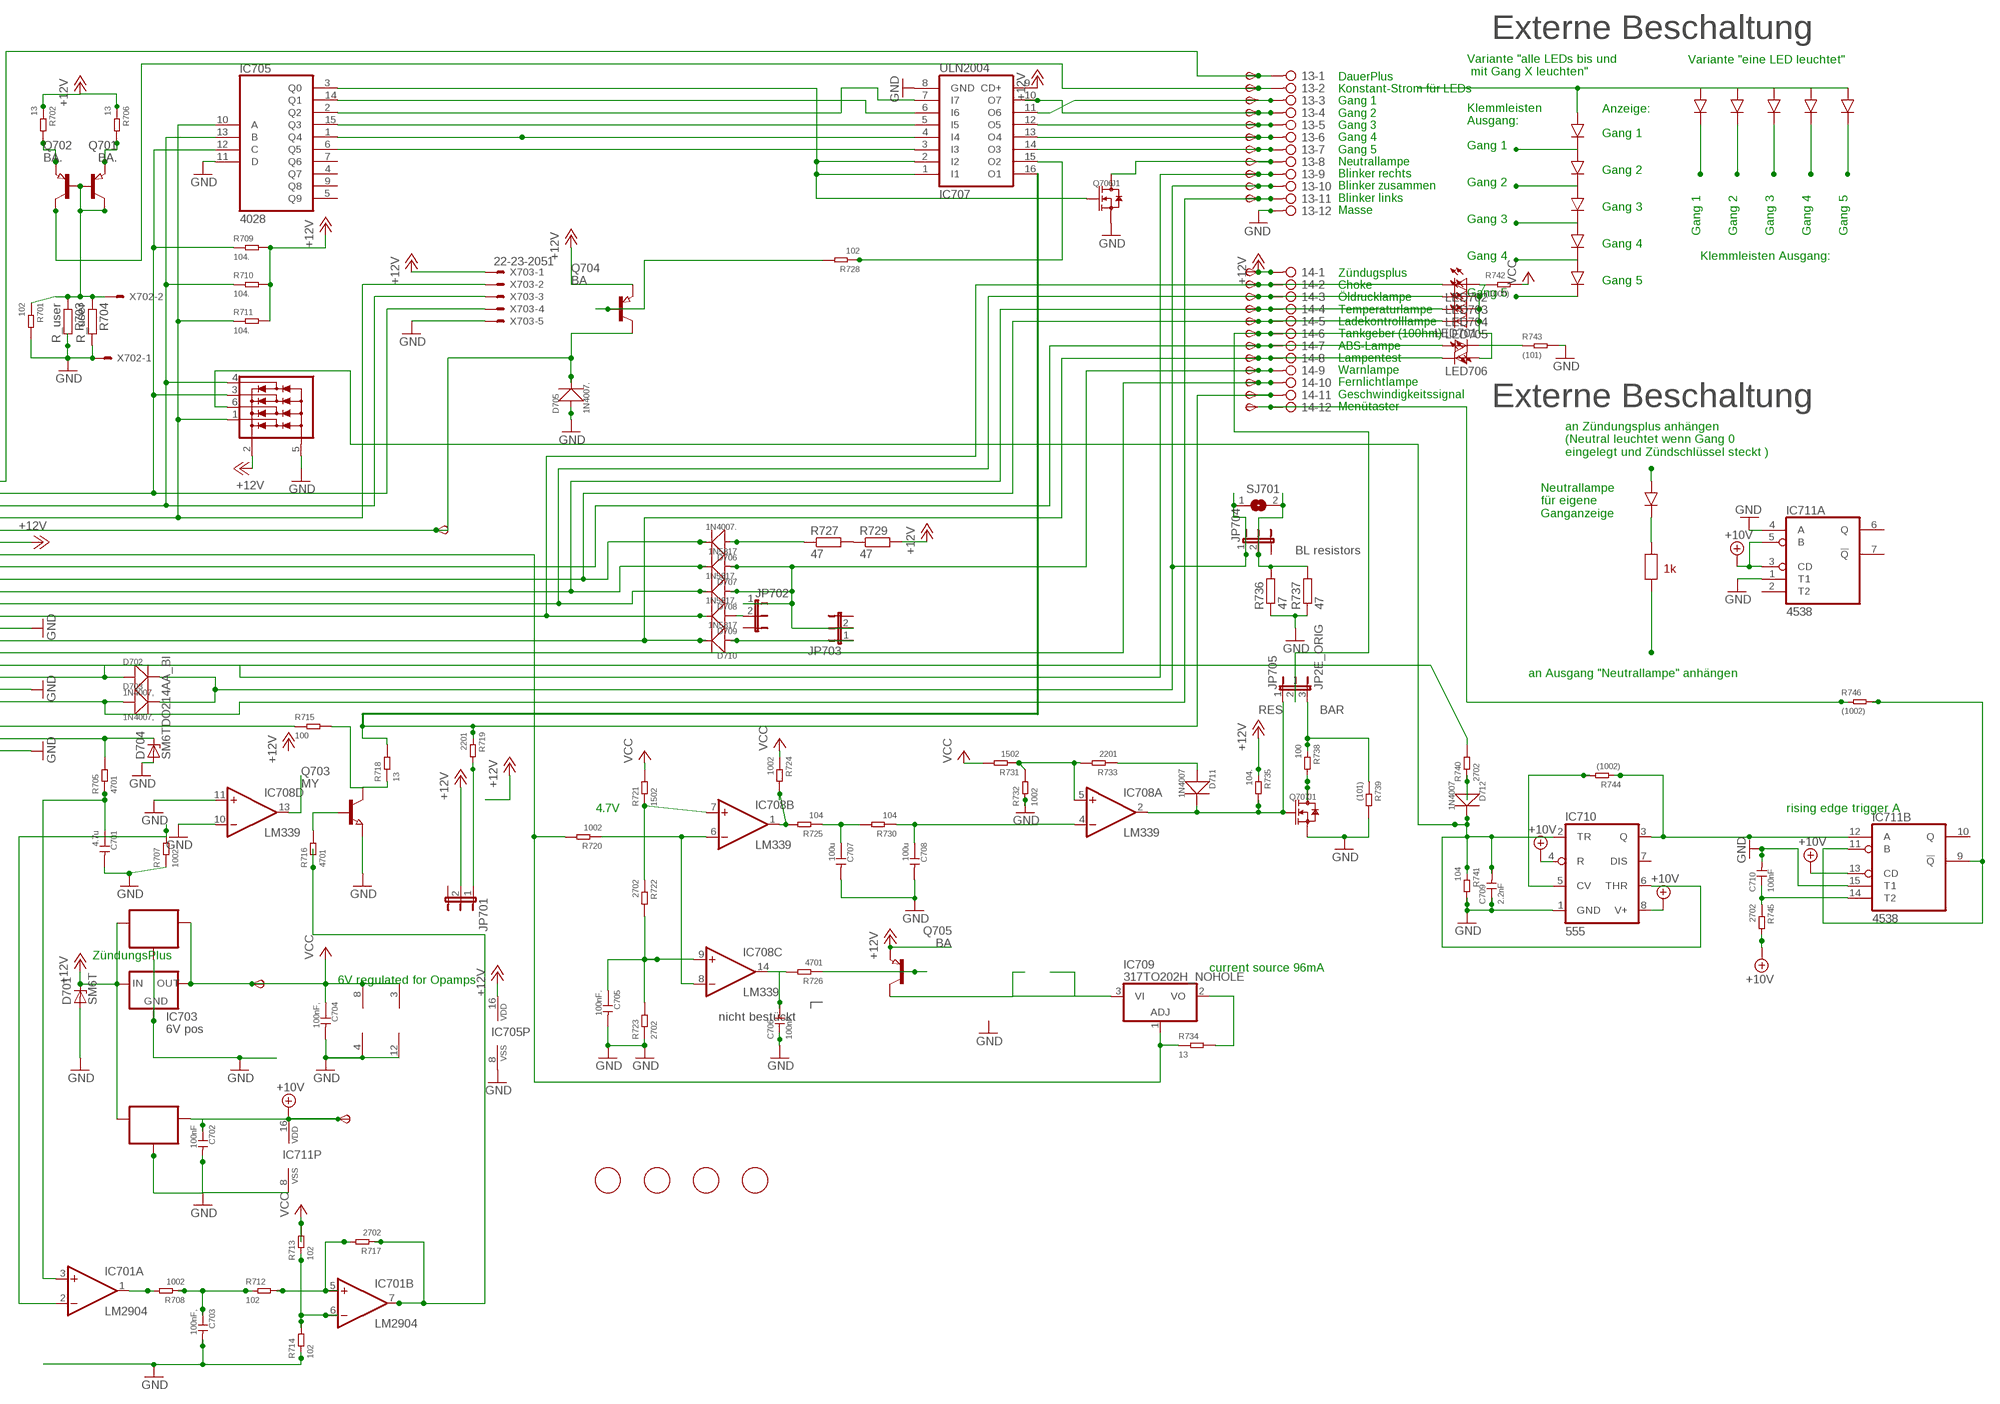
[diagram p13: schematic, sheet 7, part 2 of 2]

### Parts
6V701  TPSB2.0  [B2.0]
10V701  TPSB2.0  [B2.0]
13  2081-1132  [12-PIN]
14  2081-1132  [12-PIN]
C701  4.7u  CERAMIC-4.7UF-25V-10%-X5R(0805)  [C0805]
C702  100nF  CERAMIC-100NF-50V-10%-X7R(0805)  [C0805]
C703  100nF,  CERAMIC-100NF-50V-10%-X7R(0805)  [C0805]
C704  100nF,  CERAMIC-100NF-50V-10%-X7R(0805)  [C0805]
C705  100nF.  CERAMIC-100NF-50V-10%-X7R(0805)  [C0805]
C706  100nF.  CERAMIC-100NF-50V-10%-X7R(0805)  [C0805]
C707  100u  CERAMIC-100UF-6.3V-20%-X5R(1206)  [C1206]
C708  100u  CERAMIC-100UF-6.3V-20%-X5R(1206)  [C1206]
C709  2.2nF  CERAMIC-100NF-50V-10%-X7R(0805)  [C0805]
C710  100nF  CERAMIC-100NF-50V-10%-X7R(0805)  [C0805]
D701  SM6T  [DO214AA]
D702  1N4007,  DIODE-GEN-PURPOSE-1KV-1A(DO-214AC)  [DO-214AC]
D703  1N4007,  DIODE-GEN-PURPOSE-1KV-1A(DO-214AC)  [DO-214AC]
D704  SM6TDO214AA_BI  [DO214AA_BI]
D705  1N4007.  DIODE-GEN-PURPOSE-1KV-1A(DO-214AC)  [DO-214AC]
D706  1N4007.  DIODE-GEN-PURPOSE-1KV-1A(DO-214AC)  [DO-214AC]
D707  1N5817  DIODE-GEN-PURPOSE-1KV-1A(DO-214AC)DO-214AC/1206  [DO-214AC_SLIM]
D708  1N5817.  DIODE-GEN-PURPOSE-1KV-1A(DO-214AC)DO-214AC/1206  [DO-214AC_SLIM]
D709  1N5817.  DIODE-GEN-PURPOSE-1KV-1A(DO-214AC)DO-214AC/1206  [DO-214AC_SLIM]
D710  1N5817  DIODE-GEN-PURPOSE-1KV-1A(DO-214AC)DO-214AC/1206  [DO-214AC_SLIM]
D711  1N4007  DIODE-GEN-PURPOSE-1KV-1A(DO-214AC)  [DO-214AC]
D712  1N4007  DIODE-GEN-PURPOSE-1KV-1A(DO-214AC)  [DO-214AC]
FID701  FIDUCIAL  [FIDUCIAL_1MM]
FID702  FIDUCIAL  [FIDUCIAL_1MM]
FID703  FIDUCIAL  [FIDUCIAL_1MM]
FID704  FIDUCIAL  [FIDUCIAL_1MM]
IC701  LM2904  LM358D  [SO08]
IC702  78L06  78LXXSOT89_ROUND  [SOT89_ROUND]
IC703  6V pos  78LXX  [78LXX]
IC704  78L10  78LXXSOT89_ROUND  [SOT89_ROUND]
IC705  4028  4028D  [SO16]
IC706  NUP4304SOT457_R  [SOT457R_PHILIPS]
IC707  ULN2004  ULN2004AD  [SO16]
IC708  LM339  LM339D  [SO14]
IC709  317TO202H_NOHOLE  [TO220H_NOHOLE]
IC710  555  NE555D  [SO08]
IC711  4538  4538D  [SO16]
JP701  JP2EJP2_SMALLPADS  [JP2_SMALLPADS]
JP702  JP2EJP2_SMALLPADS  [JP2_SMALLPADS]
JP703  JP2EJP2_SMALLPADS  [JP2_SMALLPADS]
JP704  JP2EJP2_SMALLPADS  [JP2_SMALLPADS]
JP705  JP2E_ORIG  [JP2_ORIG_SMALLPADS]
LED701  LEDLD260  [LD260]
LED702  LEDLD260  [LD260]
LED703  LEDLD260  [LD260]
LED704  LEDLD260  [LD260]
LED705  LEDLD260  [LD260]
LED706  LEDLD260  [LD260]
Q701  BA.  PNP-TRANSISTOR_SOT89  [SOT89]
Q702  BA.  PNP-TRANSISTOR_SOT89  [SOT89]
Q703  MY  NPN-TRANSISTOR_SOT89  [SOT89]
Q704  BA  PNP-TRANSISTOR_SOT89  [SOT89]
Q705  BA  PNP-TRANSISTOR_SOT89  [SOT89]
Q706  J1  SMD-MOSFET-N-CH-50V-200MA-BSS138W-7-F(SOT-23)  [SOT-23]
Q707  J1  SMD-MOSFET-N-CH-50V-200MA-BSS138W-7-F(SOT-23)  [SOT-23]
R701  102  SMD-RES-1K-5%-1/8W(0805)  [R0805]
R702  13  SMD-RES-13R-5%-1/4W(1206)  [R1206]
R703  R_user  R-EU_R0805  [R0805]
R704  R_user  R-EU_R0805  [R0805]
R705  4701  SMD-RES-4.7K-5%-1/8W(0805)  [R0805]
R706  13  SMD-RES-13R-5%-1/4W(1206)  [R1206]
R707  1002  SMD-RES-10K-1%-1/8W(0805)  [R0805]
R708  1002  SMD-RES-10K-1%-1/8W(0805)  [R0805]
R709  104.  SMD-RES-10K-1%-1/8W(0805)  [R0805]
R710  104.  SMD-RES-10K-1%-1/8W(0805)  [R0805]
R711  104.  SMD-RES-10K-1%-1/8W(0805)  [R0805]
R712  102  SMD-RES-1K-5%-1/8W(0805)  [R0805]
R713  102  SMD-RES-1K-5%-1/8W(0805)  [R0805]
R714  102  SMD-RES-1K-5%-1/8W(0805)  [R0805]
R715  100  SMD-RES-220R-5%-1/8W(0805)  [R0805]
R716  4701  SMD-RES-4.7K-5%-1/8W(0805)  [R0805]
R717  2702  SMD-RES-4.7K-5%-1/8W(0805)  [R0805]
R718  13  SMD-RES-13R-5%-1/4W(1206)  [R1206]
R719  2201  SMD-RES-2.2K-5%-1/8W(0805)  [R0805]
R720  1002  SMD-RES-10K-1%-1/8W(0805)  [R0805]
R721  1502  SMD-RES-10K-1%-1/8W(0805)  [R0805]
R722  2702  SMD-RES-4.7K-5%-1/8W(0805)  [R0805]
R723  2702  SMD-RES-4.7K-5%-1/8W(0805)  [R0805]
R724  1002  SMD-RES-10K-1%-1/8W(0805)  [R0805]
R725  104  SMD-RES-10K-1%-1/8W(0805)  [R0805]
R726  4701  SMD-RES-4.7K-5%-1/8W(0805)  [R0805]
R727  47  R-EU_V235/17_1MM  [V235/17_1MM]
R728  102  SMD-RES-1K-5%-1/8W(0805)  [R0805]
R729  47  R-EU_V235/17_1MM  [V235/17_1MM]
R730  104  SMD-RES-10K-1%-1/8W(0805)  [R0805]
R731  1502  SMD-RES-10K-1%-1/8W(0805)  [R0805]
R732  1002  SMD-RES-10K-1%-1/8W(0805)  [R0805]
R733  2201  SMD-RES-2.2K-5%-1/8W(0805)  [R0805]
R734  13  SMD-RES-13R-5%-1/4W(1206)  [R1206]
R735  104.  SMD-RES-10K-1%-1/8W(0805)  [R0805]
R736  47  R-EU_V235/17_1MM  [V235/17_1MM]
R737  47  R-EU_V235/17_1MM  [V235/17_1MM]
R738  100  SMD-RES-2.2K-5%-1/8W(0805)  [R0805]
R739  (101)  SMD-RES-2.2K-5%-1/8W(0805)  [R0805]
R740  2702  SMD-RES-10K-1%-1/8W(0805)  [R0805]
R741  104  SMD-RES-10K-1%-1/8W(0805)  [R0805]
R742  (1000)  SMD-RES-100R-5%-1/8W(0805)  [R0805]
R743  (101)  SMD-RES-100R-5%-1/8W(0805)  [R0805]
R744  (1002)  SMD-RES-10K-1%-1/8W(0805)  [R0805]
R745  2702  SMD-RES-4.7K-5%-1/8W(0805)  [R0805]
R746  (1002)  SMD-RES-4.7K-5%-1/8W(0805)  [R0805]
SJ701  SJ  [SJ]
START701  TPSB2.0  [B2.0]
TP139  TPSB2.0  [B2.0]
TP140  TPSB2.0  [B2.0]
TP141  TPSB2.0  [B2.0]
TP142  TPSB2.0  [B2.0]
TP143  TPSB2.0  [B2.0]
TP144  TPSB2.0  [B2.0]
TP145  TPSB2.0  [B2.0]
TP146  TPSB2.0  [B2.0]
TP147  TPSB2.0  [B2.0]
TP148  TPSB2.0  [B2.0]
TP149  TPSB2.0  [B2.0]
TP150  TPSB2.0  [B2.0]
TP151  TPSB2.0  [B2.0]
TP152  TPSB2.0  [B2.0]
TP153  TPSB2.0  [B2.0]
TP154  TPSB2.0  [B2.0]
TP155  TPSB2.0  [B2.0]
TP156  TPSB2.0  [B2.0]
TP157  TPSB1,27  [B1,27]
TP158  TPSB2.0  [B2.0]
TP159  TPSB2.0  [B2.0]
TP160  TPSB2.0  [B2.0]
TP161  TPSB2.0  [B2.0]
X701  CON_BMWV2  [24-PIN_V2]
X702  22-23-2021  [22-23-2021]
X703  22-23-2051  [22-23-2051]

### Nets
+10V: 10V701.TP(PP) C702.1 IC704.1(OUT) IC710.4(R) IC710.8(V+) IC711.3(A:CD) IC711.5(A:B) IC711.13(B:CD) IC711.16(P:VDD) R745.2 ; also sheet 1,2,3,4,5,6,8,9,10,11,12
+12V: 14.1 D701.C IC702.3(IN) IC703.IN IC704.3(IN) IC705.16(VDD) IC706.2(V+) IC707.9(CD+) JP701.2 Q704.3(E) Q705.3(E) R702.1 R706.1 R709.2 R710.2 R711.2 R729.2 R735.1 TP160.TP(PP) X701.6 X703.1 ; also sheet 1,2,3,4,5,6,8,9,10,11,12
+12V7: IC701.7(B:OUT) R716.1 R717.1
GND: 13.12 C701.2 C702.2 C703.2 C704.2 C705.2 C706.1 C707.2 C708.2 C709.1 C710.2 D701.A D704.A D705.1(+) IC701.4(P:V-) IC702.2(GND) IC702.2@1(GND) IC703.GND IC704.2(GND) IC704.2@1(GND) IC705.8(VSS) IC705.11(D) IC706.5(V-) IC707.8(GND) IC708.10(D:-IN) IC708.11(D:+IN) IC708.12(P:GND) IC710.1(GND) IC711.1(A:T1) IC711.4(A:A) IC711.8(P:VSS) IC711.15(B:T1) Q703.3(E) Q706.2(S) Q707.2(S) R701.2 R703.2 R704.2 R707.1 R714.1 R723.1 R732.1 R736.1 R737.1 R739.2 R741.2 R743.2 X701.13 X701.18 X701.23 X702.1 X703.5 ; also sheet 1,2,3,4,5,6,8,9,10,11,12
N$595: R727.2 R729.1
N$596: 14.9 D707.1(+) D708.1(+) JP702.1 JP703.2 TP157.TP(PP)
N$597: IC705.10(A) IC706.1(D1) R711.1 X701.4 X703.2
N$598: IC705.13(B) IC706.4(D4) R710.1 X701.3 X703.3
N$599: D705.2(-) Q704.2(C) START701.TP(PP) X701.5
N$600: IC705.12(C) IC706.3(D3) R709.1 X701.2 X703.4
N$601: 14.7 LED701.A TP155.TP(PP) X701.8
N$602: 14.2 D709.2(-) LED702.K(C) TP150.TP(PP) X701.12
N$603: 14.3 D708.2(-) LED703.K(C) TP151.TP(PP) X701.11
N$604: 14.4 D707.2(-) LED704.K(C) TP152.TP(PP) X701.10
N$605: 14.8 D710.2(-) LED706.K(C) TP156.TP(PP) X701.14
N$606: 13.9 D702.1(+) TP147.TP(PP) X701.17
N$607: 13.11 D703.1(+) TP149.TP(PP) X701.19
N$608: D704.C R705.2 X701.22
N$609: C701.1 IC701.3(A:+IN) R705.1
N$610: 14.11 IC707.16(O1) R718.2 R719.1 TP159.TP(PP)
N$611: IC708.1(B:OUT) R724.2 R725.2
N$612: C707.1 R725.1 R730.2
N$613: C708.1 IC708.4(A:-IN) R730.1
N$614: IC708.5(A:+IN) R731.1 R732.2 R733.2
N$615: D711.1(+) R733.1
N$616: C705.1 IC708.9(C:+IN) R722.2 R723.2
N$617: C706.2 IC708.14(C:OUT) R726.2
N$618: Q705.1(B) R726.1
N$619: IC705.2(Q2) IC707.7(I7)
N$620: 13.5 IC707.12(O5) TP143.TP(PP)
N$621: IC705.1(Q4) IC707.4(I4)
N$622: 13.8 Q706.3(D) TP146.TP(PP)
N$623: 14.10 TP158.TP(PP) X701.15
N$624: 14.5 D706.2(-) LED705.K(C) TP153.TP(PP) X701.9
N$625: D706.1(+) R727.1
N$626: IC705.6(Q5) IC707.3(I3)
N$627: 13.4 IC707.10(O7) TP142.TP(PP)
N$628: IC709.1(ADJ) R720.2 R734.1 X701.7
N$629: IC708.6(B:-IN) IC708.8(C:-IN) R720.1
N$630: 13.2 Q701.2(C) TP140.TP(PP)
N$631: 13.1 TP139.TP(PP) X701.1
N$645: R740.2 X701.16
N$646: IC705.15(Q3) IC707.5(I5)
N$647: 13.6 IC707.13(O4) TP144.TP(PP)
N$648: 13.7 IC707.14(O3) TP145.TP(PP)
N$649: 14.6 JP705.2 TP154.TP(PP)
N$650: LED701.K(C) R743.1
N$651: LED702.A LED703.A LED704.A LED705.A LED706.A R742.1
N$652: Q704.1(B) R728.2
N$653: IC705.3(Q0) IC707.1(I1) IC707.2(I2) Q706.1(G)
N$654: IC705.14(Q1) IC707.6(I6)
N$655: 13.3 IC707.11(O6) TP141.TP(PP)
N$656: Q701.1(B) Q702.1(B) Q702.2(C) R701.1 R703.1 R704.1 X702.2
N$657: Q701.3(E) R702.2
N$658: Q702.3(E) R706.2
N$659: IC708.7(B:+IN) R721.1 R722.1
N$660: IC701.2(A:-IN) R707.2
N$661: Q703.1(B) R716.2
N$662: Q707.3(D) R738.2
N$663: IC709.2(VO) R734.2
N$664: IC709.3(VI) Q705.2(C)
N$665: C709.2 D712.2(-) IC706.6(D2) IC710.2(TR) IC710.6(THR) R741.1
N$666: IC710.5(CV) R744.2
N$667: IC710.3(Q) IC711.12(B:A) R744.1
N$668: D712.1(+) R740.1
N$669: 13.10 D702.2(-) D703.2(-) JP704.1 SJ701.1 TP148.TP(PP)
N$670: JP704.2 R736.2 R737.2 SJ701.2
N$671: IC711.9(B:!Q) IC711.11(B:B) R746.2
N$672: C710.1 IC711.14(B:T2) R745.1
N$673: JP701.1 R719.2
N$674: IC707.15(O2) R728.1
N$675: 14.12 R746.1 TP161.TP(PP)
N$676: D709.1(+) JP702.2
N$677: D711.2(-) IC708.2(A:OUT) JP705.1 Q707.1(G) R735.2
N$678: IC701.1(A:OUT) R708.2
N$679: C703.1 R708.1 R712.1
N$680: IC701.5(B:+IN) R712.2 R717.2
N$681: IC701.6(B:-IN) R713.1 R714.2
N$682: D710.1(+) JP703.1
N$683: JP705.3 R738.1 R739.1
N$684: IC708.13(D:OUT)
N$685: R715.1 X701.21
N$686: Q703.2(C) R715.2 R718.1
VCC: 6V701.TP(PP) C704.1 IC701.8(P:V+) IC702.1(OUT) IC703.OUT IC708.3(P:V+) R713.2 R721.2 R724.1 R731.2 R742.2 ; also sheet 1,2,3,4,5,6,8,9,10,11,12
Unconnected: IC705.4(Q7) IC705.5(Q9) IC705.7(Q6) IC705.9(Q8) IC710.7(DIS) IC711.2(A:T2) IC711.6(A:Q) IC711.7(A:!Q) IC711.10(B:Q) X701.20 X701.24

### Notes on the sheet
- Externe Beschaltung
- Variante "eine LED leuchtet"
- Variante "alle LEDs bis und
   mit Gang X leuchten"
- Anzeige:
- Klemmleisten
  Ausgang:
- Gang 1
- DauerPlus
  Konstant-Strom für LEDs
  Gang 1
  Gang 2
  Gang 3
  Gang 4
  Gang 5
  Neutrallampe
  Blinker rechts
  Blinker zusammen
  Blinker links
  Masse
- Gang 1
- Gang 2
- Gang 2
- Gang 3
- Gang 3
- Gang 1 | Gang 2 | Gang 3 | Gang 4 | Gang 5
- Gang 4
- Gang 4 | Klemmleisten Ausgang:
- Gang 5
- Gang 5
- Zündugsplus
  Choke
  Öldrucklampe
  Temperaturlampe
  Ladekontrolllampe
  Tankgeber (100hm)
  ABS-Lampe
  Lampentest
  Warnlampe
  Fernlichtlampe
  Geschwindigkeitssignal
  Menütaster
- Stromquelle für Gang
  LEDs. Für mehr als 12mA
  muss ein Widerstand "R_user"
  eingelötet werden. Für weniger
  muss der 1kOhm SMD Widerstand
  neben R_user entfernt werden
  I = 12V/1kOhm(default)+12V/R_user
  I= 12mA (default) + 12V/R_user
  Beispiel:
  R_user      Strom in LEDs
  1 kOhm     22-26mA
  ohne       11-13mA
- Externe Beschaltung
- an Zündungsplus anhängen
  (Neutral leuchtet wenn Gang 0
  eingelegt und Zündschlüssel steckt )
- Neutrallampe
  für eigene
  Ganganzeige
- DauerPlus Batterie 12V (rot weiss)
  Ganganzeige Signal C (gelb weiss)
  Ganganzeige Signal B (gelb schwarz)
  Ganganzeige Signal A (gelb dunkelblau)
  12V/350mA zum Starknopf (schwarz grün)
  Zündungsplus 12V (grün schwarz)
  Reservelampe (weiss)
  ABS Leuchte (blau)
  Ladekontrollleuchte (schaltet auf Masse) (violett schwarz)
  Temperaturleuchte (schaltet auf Masse) (braun schwarz)
  Öldruckleuchte (schaltet auf Masse) (braun grün)
  Chokelampe (schaltet auf Masse) (violett weiss)
- BL resistors
- 1k
- an Ausgang "Neutrallampe" anhängen
- Masse (braun)
  Lampentest (schaltet auf Masse)(weiss blau)
  Fernlichtlampe (12V) (weiss)
  Drehzahl Zündspule (schwarz blau)
  Blinker rechts (blau scharz)
  Masse (braun)
  Blinker links (blau rot)
  nicht angeschlossen
  Tachosiganl zum Blinrelais (balu grün)
  Tachogeber (gelb)
  Masse Tachobeger (braun)
  Tachobeleuchtung (12V Zündungsplus) (grau blau)
- RES | BAR
- 4.7V | rising edge trigger A
- ZündungsPlus
- current source 96mA
- 6V regulated for Opamps
- nicht bestückt

## Sheet 8 of 12
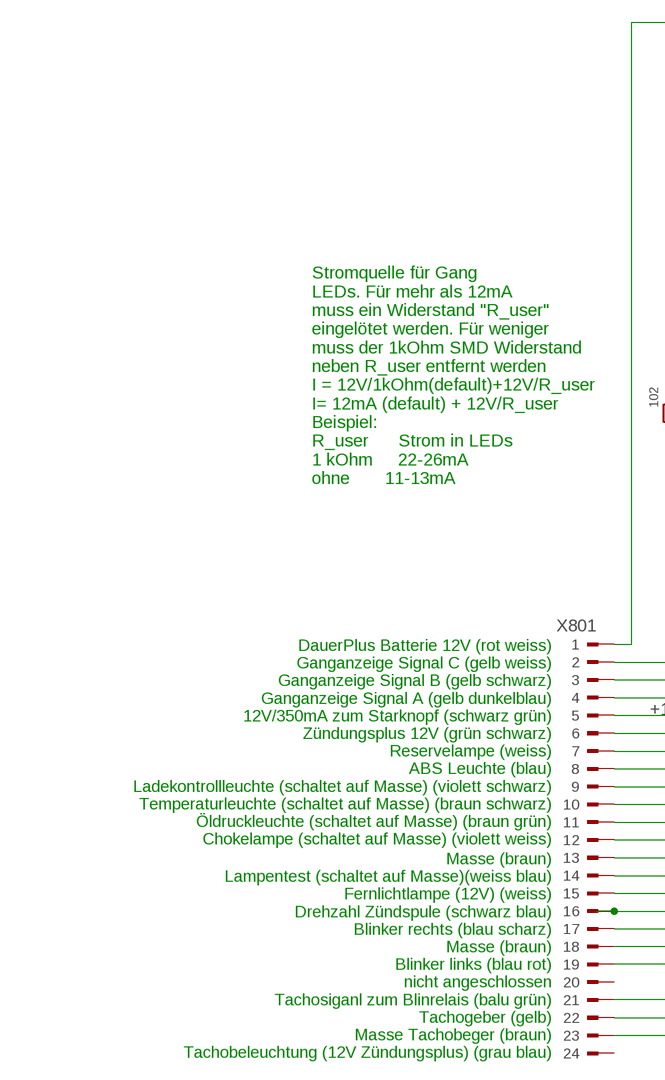
[diagram p14: schematic, sheet 8, part 1 of 2]
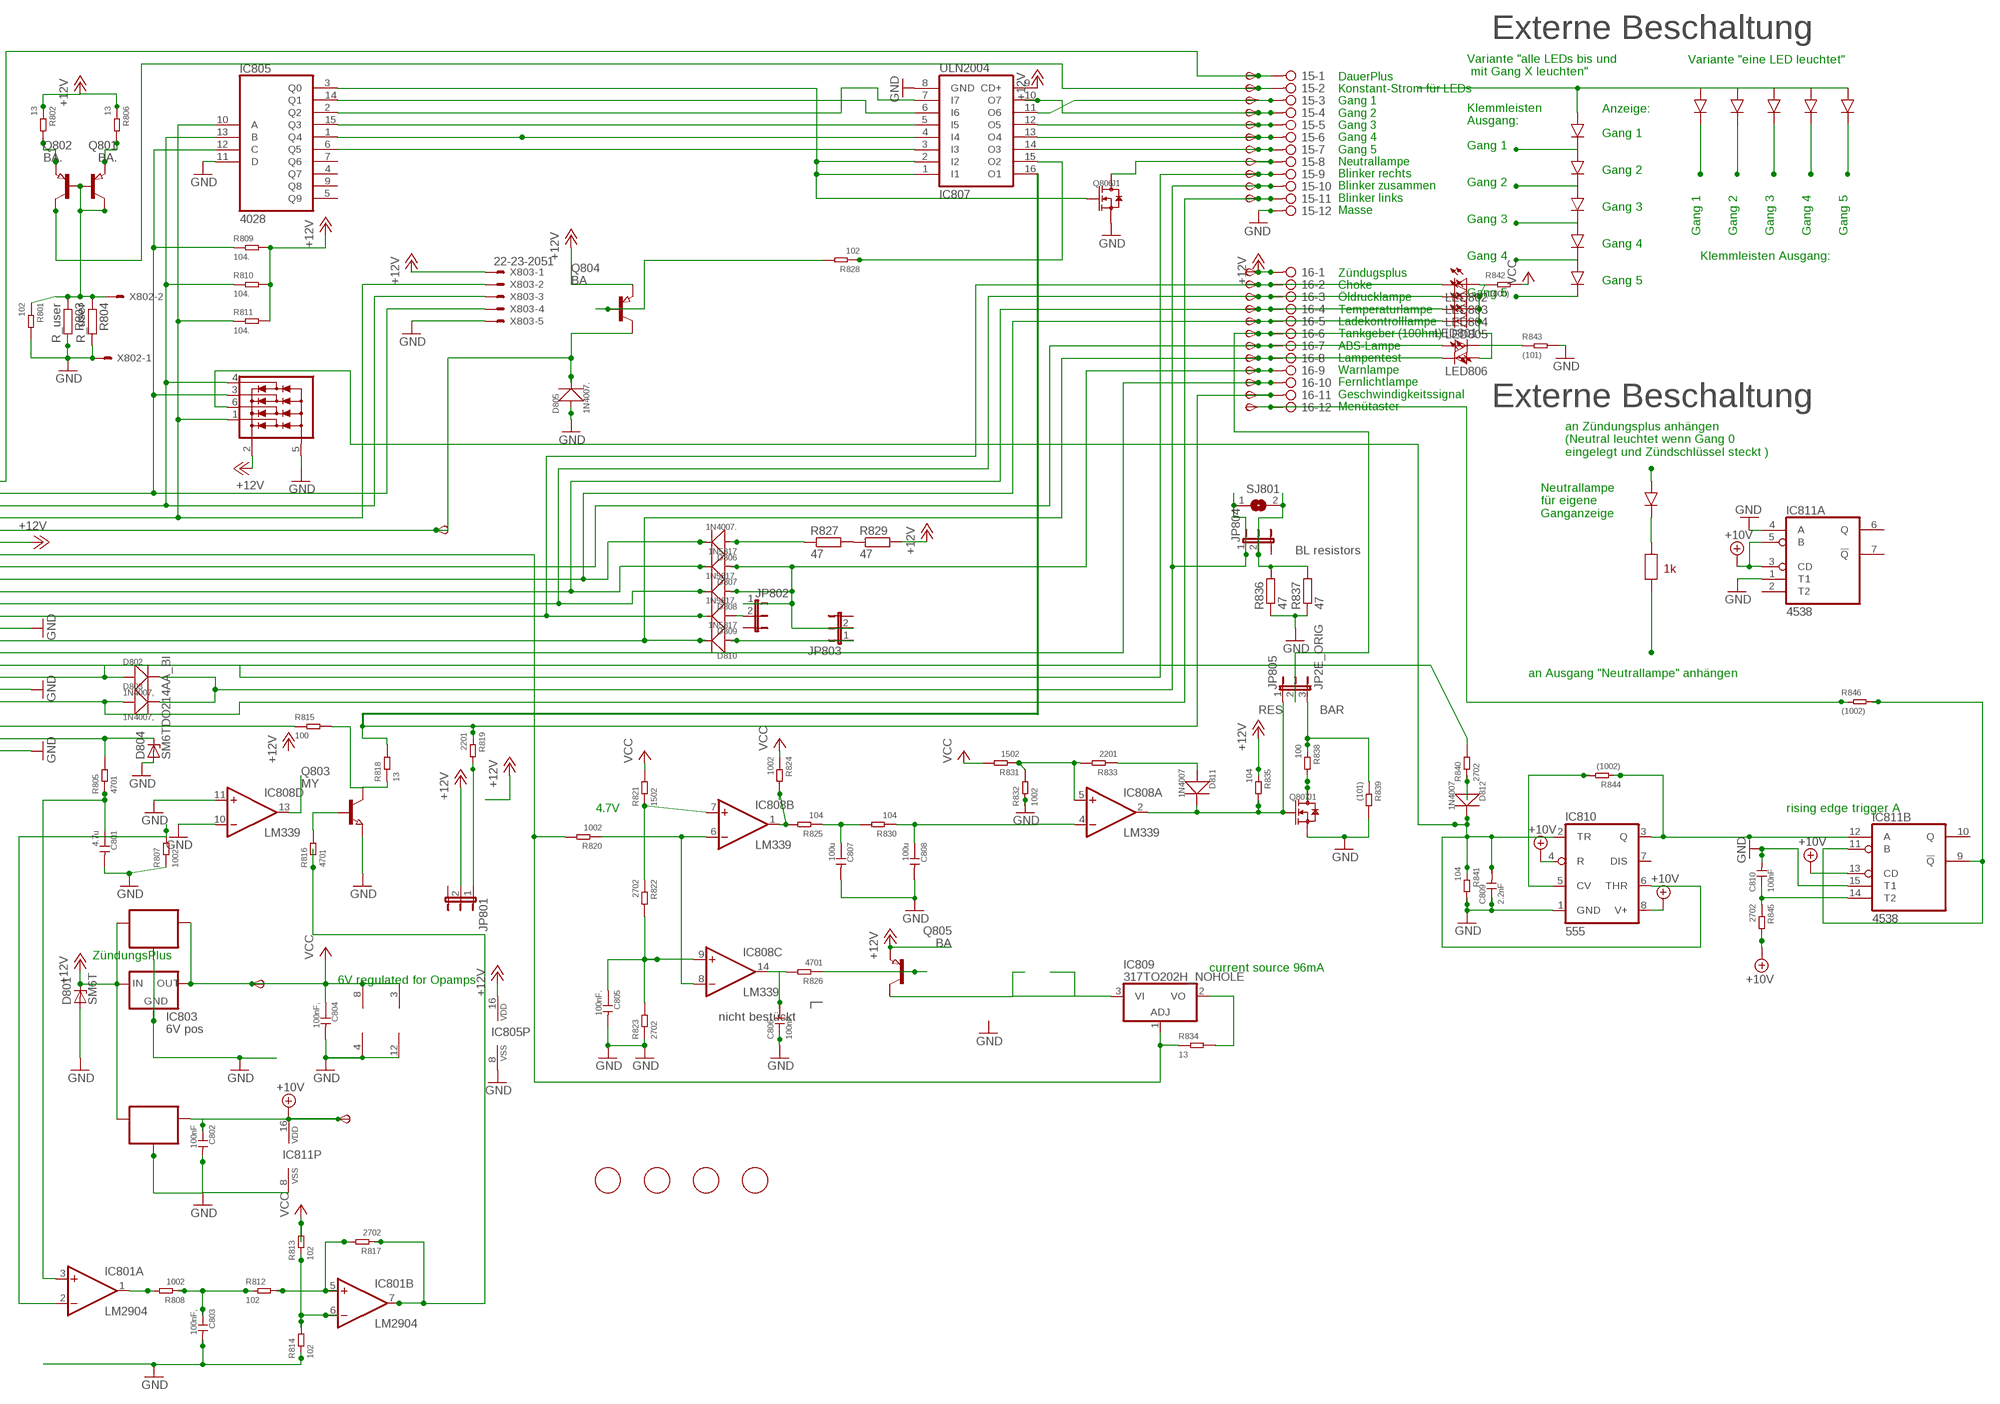
[diagram p15: schematic, sheet 8, part 2 of 2]

### Parts
6V801  TPSB2.0  [B2.0]
10V801  TPSB2.0  [B2.0]
15  2081-1132  [12-PIN]
16  2081-1132  [12-PIN]
C801  4.7u  CERAMIC-4.7UF-25V-10%-X5R(0805)  [C0805]
C802  100nF  CERAMIC-100NF-50V-10%-X7R(0805)  [C0805]
C803  100nF,  CERAMIC-100NF-50V-10%-X7R(0805)  [C0805]
C804  100nF,  CERAMIC-100NF-50V-10%-X7R(0805)  [C0805]
C805  100nF.  CERAMIC-100NF-50V-10%-X7R(0805)  [C0805]
C806  100nF.  CERAMIC-100NF-50V-10%-X7R(0805)  [C0805]
C807  100u  CERAMIC-100UF-6.3V-20%-X5R(1206)  [C1206]
C808  100u  CERAMIC-100UF-6.3V-20%-X5R(1206)  [C1206]
C809  2.2nF  CERAMIC-100NF-50V-10%-X7R(0805)  [C0805]
C810  100nF  CERAMIC-100NF-50V-10%-X7R(0805)  [C0805]
D801  SM6T  [DO214AA]
D802  1N4007,  DIODE-GEN-PURPOSE-1KV-1A(DO-214AC)  [DO-214AC]
D803  1N4007,  DIODE-GEN-PURPOSE-1KV-1A(DO-214AC)  [DO-214AC]
D804  SM6TDO214AA_BI  [DO214AA_BI]
D805  1N4007.  DIODE-GEN-PURPOSE-1KV-1A(DO-214AC)  [DO-214AC]
D806  1N4007.  DIODE-GEN-PURPOSE-1KV-1A(DO-214AC)  [DO-214AC]
D807  1N5817  DIODE-GEN-PURPOSE-1KV-1A(DO-214AC)DO-214AC/1206  [DO-214AC_SLIM]
D808  1N5817.  DIODE-GEN-PURPOSE-1KV-1A(DO-214AC)DO-214AC/1206  [DO-214AC_SLIM]
D809  1N5817.  DIODE-GEN-PURPOSE-1KV-1A(DO-214AC)DO-214AC/1206  [DO-214AC_SLIM]
D810  1N5817  DIODE-GEN-PURPOSE-1KV-1A(DO-214AC)DO-214AC/1206  [DO-214AC_SLIM]
D811  1N4007  DIODE-GEN-PURPOSE-1KV-1A(DO-214AC)  [DO-214AC]
D812  1N4007  DIODE-GEN-PURPOSE-1KV-1A(DO-214AC)  [DO-214AC]
FID801  FIDUCIAL  [FIDUCIAL_1MM]
FID802  FIDUCIAL  [FIDUCIAL_1MM]
FID803  FIDUCIAL  [FIDUCIAL_1MM]
FID804  FIDUCIAL  [FIDUCIAL_1MM]
IC801  LM2904  LM358D  [SO08]
IC802  78L06  78LXXSOT89_ROUND  [SOT89_ROUND]
IC803  6V pos  78LXX  [78LXX]
IC804  78L10  78LXXSOT89_ROUND  [SOT89_ROUND]
IC805  4028  4028D  [SO16]
IC806  NUP4304SOT457_R  [SOT457R_PHILIPS]
IC807  ULN2004  ULN2004AD  [SO16]
IC808  LM339  LM339D  [SO14]
IC809  317TO202H_NOHOLE  [TO220H_NOHOLE]
IC810  555  NE555D  [SO08]
IC811  4538  4538D  [SO16]
JP801  JP2EJP2_SMALLPADS  [JP2_SMALLPADS]
JP802  JP2EJP2_SMALLPADS  [JP2_SMALLPADS]
JP803  JP2EJP2_SMALLPADS  [JP2_SMALLPADS]
JP804  JP2EJP2_SMALLPADS  [JP2_SMALLPADS]
JP805  JP2E_ORIG  [JP2_ORIG_SMALLPADS]
LED801  LEDLD260  [LD260]
LED802  LEDLD260  [LD260]
LED803  LEDLD260  [LD260]
LED804  LEDLD260  [LD260]
LED805  LEDLD260  [LD260]
LED806  LEDLD260  [LD260]
Q801  BA.  PNP-TRANSISTOR_SOT89  [SOT89]
Q802  BA.  PNP-TRANSISTOR_SOT89  [SOT89]
Q803  MY  NPN-TRANSISTOR_SOT89  [SOT89]
Q804  BA  PNP-TRANSISTOR_SOT89  [SOT89]
Q805  BA  PNP-TRANSISTOR_SOT89  [SOT89]
Q806  J1  SMD-MOSFET-N-CH-50V-200MA-BSS138W-7-F(SOT-23)  [SOT-23]
Q807  J1  SMD-MOSFET-N-CH-50V-200MA-BSS138W-7-F(SOT-23)  [SOT-23]
R801  102  SMD-RES-1K-5%-1/8W(0805)  [R0805]
R802  13  SMD-RES-13R-5%-1/4W(1206)  [R1206]
R803  R_user  R-EU_R0805  [R0805]
R804  R_user  R-EU_R0805  [R0805]
R805  4701  SMD-RES-4.7K-5%-1/8W(0805)  [R0805]
R806  13  SMD-RES-13R-5%-1/4W(1206)  [R1206]
R807  1002  SMD-RES-10K-1%-1/8W(0805)  [R0805]
R808  1002  SMD-RES-10K-1%-1/8W(0805)  [R0805]
R809  104.  SMD-RES-10K-1%-1/8W(0805)  [R0805]
R810  104.  SMD-RES-10K-1%-1/8W(0805)  [R0805]
R811  104.  SMD-RES-10K-1%-1/8W(0805)  [R0805]
R812  102  SMD-RES-1K-5%-1/8W(0805)  [R0805]
R813  102  SMD-RES-1K-5%-1/8W(0805)  [R0805]
R814  102  SMD-RES-1K-5%-1/8W(0805)  [R0805]
R815  100  SMD-RES-220R-5%-1/8W(0805)  [R0805]
R816  4701  SMD-RES-4.7K-5%-1/8W(0805)  [R0805]
R817  2702  SMD-RES-4.7K-5%-1/8W(0805)  [R0805]
R818  13  SMD-RES-13R-5%-1/4W(1206)  [R1206]
R819  2201  SMD-RES-2.2K-5%-1/8W(0805)  [R0805]
R820  1002  SMD-RES-10K-1%-1/8W(0805)  [R0805]
R821  1502  SMD-RES-10K-1%-1/8W(0805)  [R0805]
R822  2702  SMD-RES-4.7K-5%-1/8W(0805)  [R0805]
R823  2702  SMD-RES-4.7K-5%-1/8W(0805)  [R0805]
R824  1002  SMD-RES-10K-1%-1/8W(0805)  [R0805]
R825  104  SMD-RES-10K-1%-1/8W(0805)  [R0805]
R826  4701  SMD-RES-4.7K-5%-1/8W(0805)  [R0805]
R827  47  R-EU_V235/17_1MM  [V235/17_1MM]
R828  102  SMD-RES-1K-5%-1/8W(0805)  [R0805]
R829  47  R-EU_V235/17_1MM  [V235/17_1MM]
R830  104  SMD-RES-10K-1%-1/8W(0805)  [R0805]
R831  1502  SMD-RES-10K-1%-1/8W(0805)  [R0805]
R832  1002  SMD-RES-10K-1%-1/8W(0805)  [R0805]
R833  2201  SMD-RES-2.2K-5%-1/8W(0805)  [R0805]
R834  13  SMD-RES-13R-5%-1/4W(1206)  [R1206]
R835  104  SMD-RES-10K-1%-1/8W(0805)  [R0805]
R836  47  R-EU_V235/17_1MM  [V235/17_1MM]
R837  47  R-EU_V235/17_1MM  [V235/17_1MM]
R838  100  SMD-RES-2.2K-5%-1/8W(0805)  [R0805]
R839  (101)  SMD-RES-2.2K-5%-1/8W(0805)  [R0805]
R840  2702  SMD-RES-10K-1%-1/8W(0805)  [R0805]
R841  104  SMD-RES-10K-1%-1/8W(0805)  [R0805]
R842  (1000)  SMD-RES-100R-5%-1/8W(0805)  [R0805]
R843  (101)  SMD-RES-100R-5%-1/8W(0805)  [R0805]
R844  (1002)  SMD-RES-10K-1%-1/8W(0805)  [R0805]
R845  2702  SMD-RES-4.7K-5%-1/8W(0805)  [R0805]
R846  (1002)  SMD-RES-4.7K-5%-1/8W(0805)  [R0805]
SJ801  SJ  [SJ]
START801  TPSB2.0  [B2.0]
TP162  TPSB2.0  [B2.0]
TP163  TPSB2.0  [B2.0]
TP164  TPSB2.0  [B2.0]
TP165  TPSB2.0  [B2.0]
TP166  TPSB2.0  [B2.0]
TP167  TPSB2.0  [B2.0]
TP168  TPSB2.0  [B2.0]
TP169  TPSB2.0  [B2.0]
TP170  TPSB2.0  [B2.0]
TP171  TPSB2.0  [B2.0]
TP172  TPSB2.0  [B2.0]
TP173  TPSB2.0  [B2.0]
TP174  TPSB2.0  [B2.0]
TP175  TPSB2.0  [B2.0]
TP176  TPSB2.0  [B2.0]
TP177  TPSB2.0  [B2.0]
TP178  TPSB2.0  [B2.0]
TP179  TPSB2.0  [B2.0]
TP180  TPSB1,27  [B1,27]
TP181  TPSB2.0  [B2.0]
TP182  TPSB2.0  [B2.0]
TP183  TPSB2.0  [B2.0]
TP184  TPSB2.0  [B2.0]
X801  CON_BMWV2  [24-PIN_V2]
X802  22-23-2021  [22-23-2021]
X803  22-23-2051  [22-23-2051]

### Nets
+10V: 10V801.TP(PP) C802.1 IC804.1(OUT) IC810.4(R) IC810.8(V+) IC811.3(A:CD) IC811.5(A:B) IC811.13(B:CD) IC811.16(P:VDD) R845.2 ; also sheet 1,2,3,4,5,6,7,9,10,11,12
+12V: 16.1 D801.C IC802.3(IN) IC803.IN IC804.3(IN) IC805.16(VDD) IC806.2(V+) IC807.9(CD+) JP801.2 Q804.3(E) Q805.3(E) R802.1 R806.1 R809.2 R810.2 R811.2 R829.2 R835.1 TP183.TP(PP) X801.6 X803.1 ; also sheet 1,2,3,4,5,6,7,9,10,11,12
+12V8: IC801.7(B:OUT) R816.1 R817.1
GND: 15.12 C801.2 C802.2 C803.2 C804.2 C805.2 C806.1 C807.2 C808.2 C809.1 C810.2 D801.A D804.A D805.1(+) IC801.4(P:V-) IC802.2(GND) IC802.2@1(GND) IC803.GND IC804.2(GND) IC804.2@1(GND) IC805.8(VSS) IC805.11(D) IC806.5(V-) IC807.8(GND) IC808.10(D:-IN) IC808.11(D:+IN) IC808.12(P:GND) IC810.1(GND) IC811.1(A:T1) IC811.4(A:A) IC811.8(P:VSS) IC811.15(B:T1) Q803.3(E) Q806.2(S) Q807.2(S) R801.2 R803.2 R804.2 R807.1 R814.1 R823.1 R832.1 R836.1 R837.1 R839.2 R841.2 R843.2 X801.13 X801.18 X801.23 X802.1 X803.5 ; also sheet 1,2,3,4,5,6,7,9,10,11,12
N$687: R827.2 R829.1
N$688: 16.9 D807.1(+) D808.1(+) JP802.1 JP803.2 TP180.TP(PP)
N$689: IC805.10(A) IC806.1(D1) R811.1 X801.4 X803.2
N$690: IC805.13(B) IC806.4(D4) R810.1 X801.3 X803.3
N$691: D805.2(-) Q804.2(C) START801.TP(PP) X801.5
N$692: IC805.12(C) IC806.3(D3) R809.1 X801.2 X803.4
N$693: 16.7 LED801.A TP178.TP(PP) X801.8
N$694: 16.2 D809.2(-) LED802.K(C) TP173.TP(PP) X801.12
N$695: 16.3 D808.2(-) LED803.K(C) TP174.TP(PP) X801.11
N$696: 16.4 D807.2(-) LED804.K(C) TP175.TP(PP) X801.10
N$697: 16.8 D810.2(-) LED806.K(C) TP179.TP(PP) X801.14
N$698: 15.9 D802.1(+) TP170.TP(PP) X801.17
N$699: 15.11 D803.1(+) TP172.TP(PP) X801.19
N$700: D804.C R805.2 X801.22
N$701: C801.1 IC801.3(A:+IN) R805.1
N$702: 16.11 IC807.16(O1) R818.2 R819.1 TP182.TP(PP)
N$703: IC808.1(B:OUT) R824.2 R825.2
N$704: C807.1 R825.1 R830.2
N$705: C808.1 IC808.4(A:-IN) R830.1
N$706: IC808.5(A:+IN) R831.1 R832.2 R833.2
N$707: D811.1(+) R833.1
N$708: C805.1 IC808.9(C:+IN) R822.2 R823.2
N$709: C806.2 IC808.14(C:OUT) R826.2
N$710: Q805.1(B) R826.1
N$711: IC805.2(Q2) IC807.7(I7)
N$712: 15.5 IC807.12(O5) TP166.TP(PP)
N$713: IC805.1(Q4) IC807.4(I4)
N$714: 15.8 Q806.3(D) TP169.TP(PP)
N$715: 16.10 TP181.TP(PP) X801.15
N$716: 16.5 D806.2(-) LED805.K(C) TP176.TP(PP) X801.9
N$717: D806.1(+) R827.1
N$718: IC805.6(Q5) IC807.3(I3)
N$719: 15.4 IC807.10(O7) TP165.TP(PP)
N$720: IC809.1(ADJ) R820.2 R834.1 X801.7
N$721: IC808.6(B:-IN) IC808.8(C:-IN) R820.1
N$722: 15.2 Q801.2(C) TP163.TP(PP)
N$723: 15.1 TP162.TP(PP) X801.1
N$737: R840.2 X801.16
N$738: IC805.15(Q3) IC807.5(I5)
N$739: 15.6 IC807.13(O4) TP167.TP(PP)
N$740: 15.7 IC807.14(O3) TP168.TP(PP)
N$741: 16.6 JP805.2 TP177.TP(PP)
N$742: LED801.K(C) R843.1
N$743: LED802.A LED803.A LED804.A LED805.A LED806.A R842.1
N$744: Q804.1(B) R828.2
N$745: IC805.3(Q0) IC807.1(I1) IC807.2(I2) Q806.1(G)
N$746: IC805.14(Q1) IC807.6(I6)
N$747: 15.3 IC807.11(O6) TP164.TP(PP)
N$748: Q801.1(B) Q802.1(B) Q802.2(C) R801.1 R803.1 R804.1 X802.2
N$749: Q801.3(E) R802.2
N$750: Q802.3(E) R806.2
N$751: IC808.7(B:+IN) R821.1 R822.1
N$752: IC801.2(A:-IN) R807.2
N$753: Q803.1(B) R816.2
N$754: Q807.3(D) R838.2
N$755: IC809.2(VO) R834.2
N$756: IC809.3(VI) Q805.2(C)
N$757: C809.2 D812.2(-) IC806.6(D2) IC810.2(TR) IC810.6(THR) R841.1
N$758: IC810.5(CV) R844.2
N$759: IC810.3(Q) IC811.12(B:A) R844.1
N$760: D812.1(+) R840.1
N$761: 15.10 D802.2(-) D803.2(-) JP804.1 SJ801.1 TP171.TP(PP)
N$762: JP804.2 R836.2 R837.2 SJ801.2
N$763: IC811.9(B:!Q) IC811.11(B:B) R846.2
N$764: C810.1 IC811.14(B:T2) R845.1
N$765: JP801.1 R819.2
N$766: IC807.15(O2) R828.1
N$767: 16.12 R846.1 TP184.TP(PP)
N$768: D809.1(+) JP802.2
N$769: D811.2(-) IC808.2(A:OUT) JP805.1 Q807.1(G) R835.2
N$770: IC801.1(A:OUT) R808.2
N$771: C803.1 R808.1 R812.1
N$772: IC801.5(B:+IN) R812.2 R817.2
N$773: IC801.6(B:-IN) R813.1 R814.2
N$774: D810.1(+) JP803.1
N$775: JP805.3 R838.1 R839.1
N$776: IC808.13(D:OUT)
N$777: R815.1 X801.21
N$778: Q803.2(C) R815.2 R818.1
VCC: 6V801.TP(PP) C804.1 IC801.8(P:V+) IC802.1(OUT) IC803.OUT IC808.3(P:V+) R813.2 R821.2 R824.1 R831.2 R842.2 ; also sheet 1,2,3,4,5,6,7,9,10,11,12
Unconnected: IC805.4(Q7) IC805.5(Q9) IC805.7(Q6) IC805.9(Q8) IC810.7(DIS) IC811.2(A:T2) IC811.6(A:Q) IC811.7(A:!Q) IC811.10(B:Q) X801.20 X801.24

### Notes on the sheet
- Externe Beschaltung
- Variante "eine LED leuchtet"
- Variante "alle LEDs bis und
   mit Gang X leuchten"
- Anzeige:
- Klemmleisten
  Ausgang:
- Gang 1
- DauerPlus
  Konstant-Strom für LEDs
  Gang 1
  Gang 2
  Gang 3
  Gang 4
  Gang 5
  Neutrallampe
  Blinker rechts
  Blinker zusammen
  Blinker links
  Masse
- Gang 1
- Gang 2
- Gang 2
- Gang 3
- Gang 3
- Gang 1 | Gang 2 | Gang 3 | Gang 4 | Gang 5
- Gang 4
- Gang 4 | Klemmleisten Ausgang:
- Gang 5
- Gang 5
- Zündugsplus
  Choke
  Öldrucklampe
  Temperaturlampe
  Ladekontrolllampe
  Tankgeber (100hm)
  ABS-Lampe
  Lampentest
  Warnlampe
  Fernlichtlampe
  Geschwindigkeitssignal
  Menütaster
- Stromquelle für Gang
  LEDs. Für mehr als 12mA
  muss ein Widerstand "R_user"
  eingelötet werden. Für weniger
  muss der 1kOhm SMD Widerstand
  neben R_user entfernt werden
  I = 12V/1kOhm(default)+12V/R_user
  I= 12mA (default) + 12V/R_user
  Beispiel:
  R_user      Strom in LEDs
  1 kOhm     22-26mA
  ohne       11-13mA
- Externe Beschaltung
- an Zündungsplus anhängen
  (Neutral leuchtet wenn Gang 0
  eingelegt und Zündschlüssel steckt )
- Neutrallampe
  für eigene
  Ganganzeige
- DauerPlus Batterie 12V (rot weiss)
  Ganganzeige Signal C (gelb weiss)
  Ganganzeige Signal B (gelb schwarz)
  Ganganzeige Signal A (gelb dunkelblau)
  12V/350mA zum Starknopf (schwarz grün)
  Zündungsplus 12V (grün schwarz)
  Reservelampe (weiss)
  ABS Leuchte (blau)
  Ladekontrollleuchte (schaltet auf Masse) (violett schwarz)
  Temperaturleuchte (schaltet auf Masse) (braun schwarz)
  Öldruckleuchte (schaltet auf Masse) (braun grün)
  Chokelampe (schaltet auf Masse) (violett weiss)
- BL resistors
- 1k
- an Ausgang "Neutrallampe" anhängen
- Masse (braun)
  Lampentest (schaltet auf Masse)(weiss blau)
  Fernlichtlampe (12V) (weiss)
  Drehzahl Zündspule (schwarz blau)
  Blinker rechts (blau scharz)
  Masse (braun)
  Blinker links (blau rot)
  nicht angeschlossen
  Tachosiganl zum Blinrelais (balu grün)
  Tachogeber (gelb)
  Masse Tachobeger (braun)
  Tachobeleuchtung (12V Zündungsplus) (grau blau)
- RES | BAR
- 4.7V | rising edge trigger A
- ZündungsPlus
- current source 96mA
- 6V regulated for Opamps
- nicht bestückt